# EAGLE design InkTime (EAGLE 9.7.0)

## Sheet 1 of 2
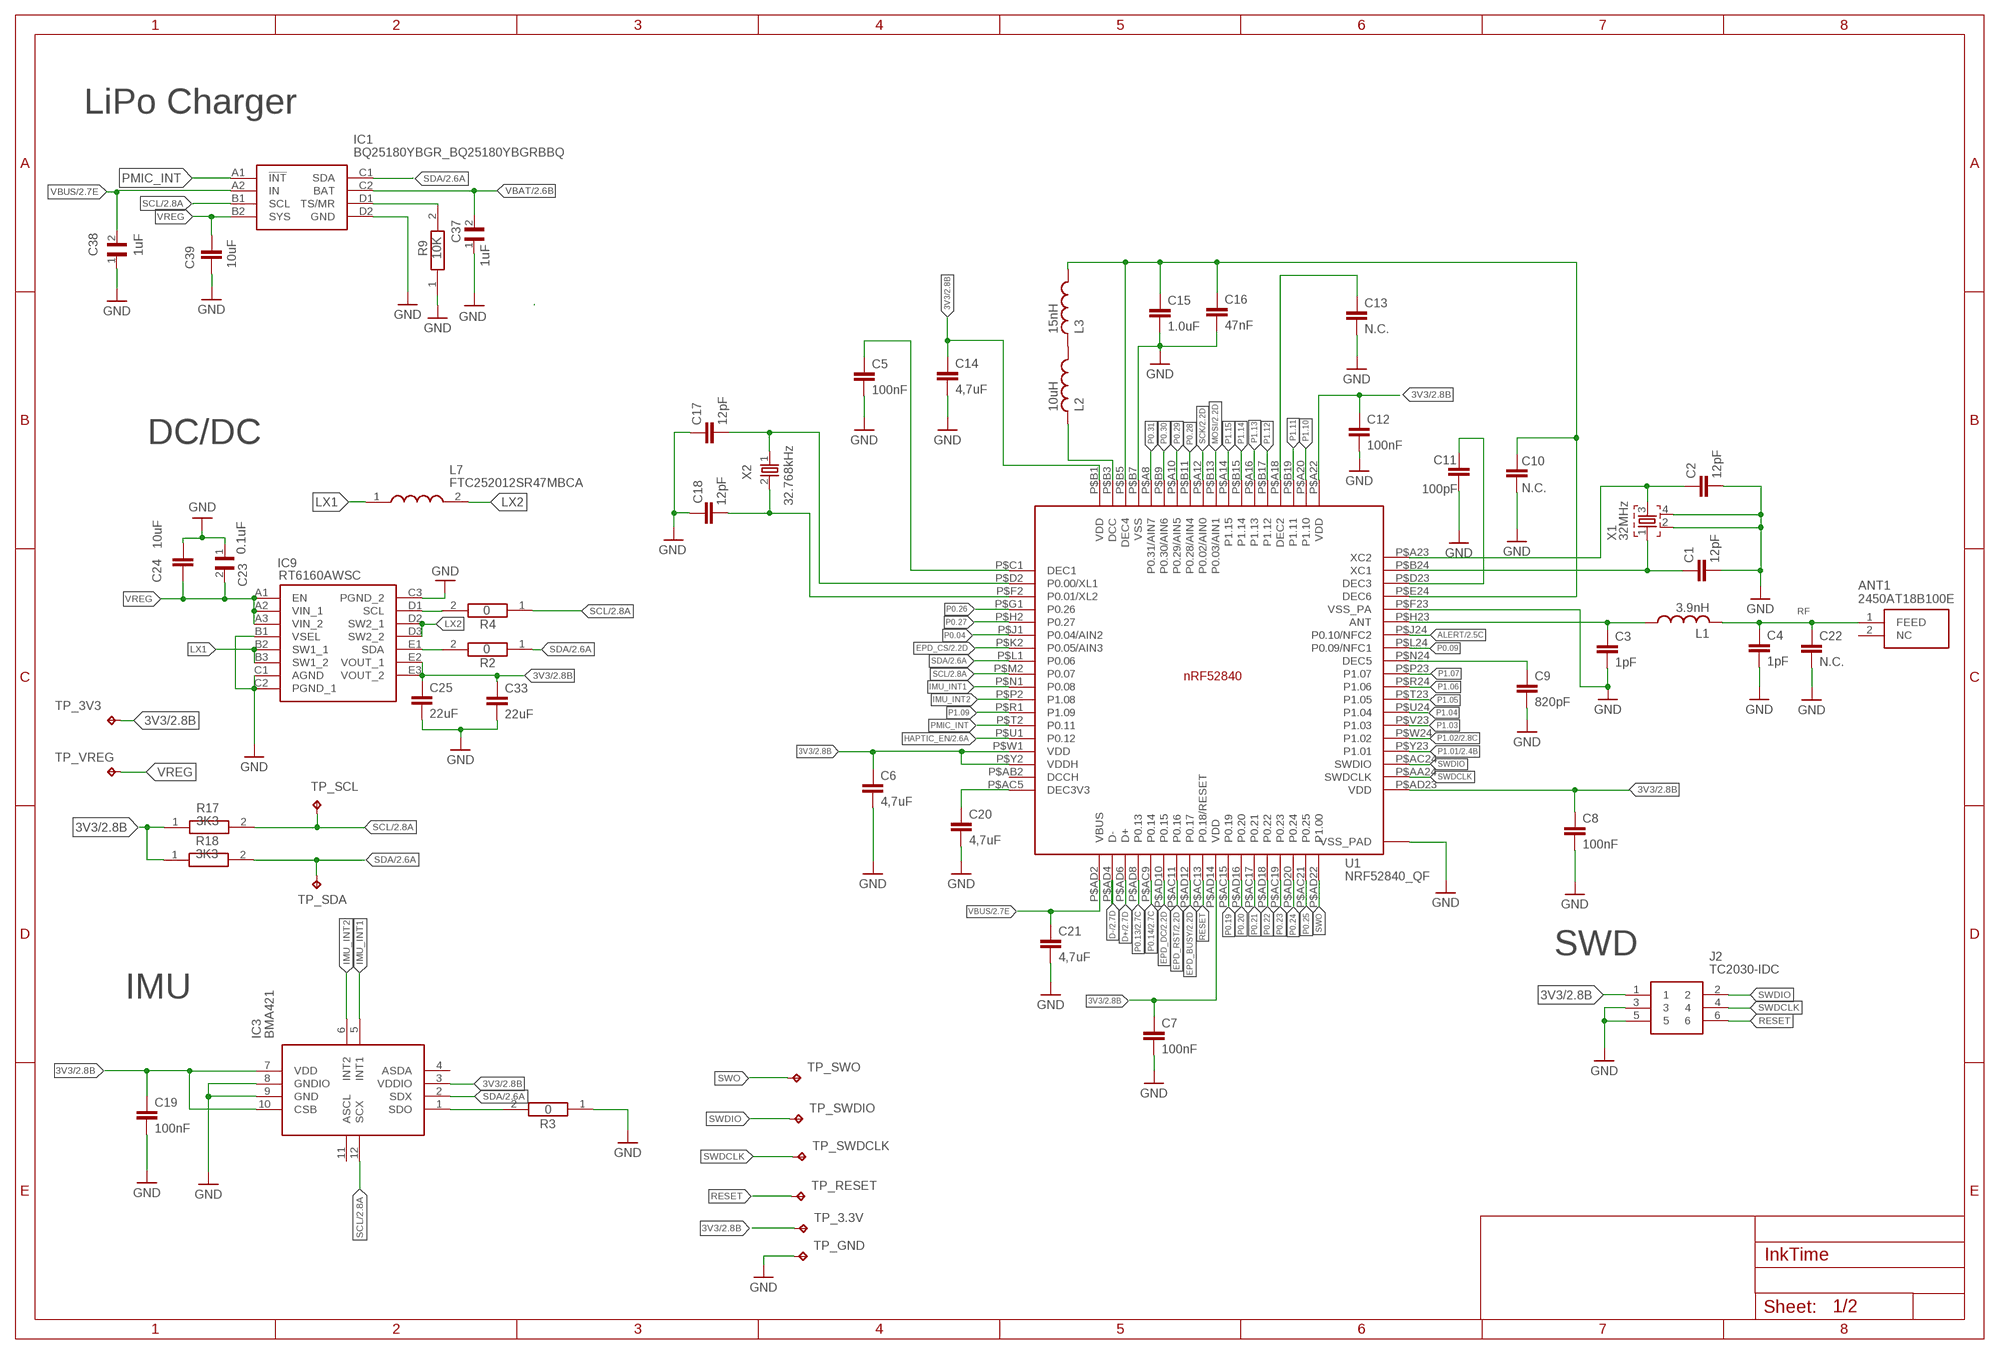
[diagram p0: schematic, sheet 1]

### Parts
ANT1  2450AT18B100E  2450AT18B100E_2450AT18B100E  [2450AT18B100E_ANTC3216X140N]
C1  12pF  NORDIC_NRF_3_CAPACITOR_0201_N  [NORDIC_NRF_3_RESC0201_N]
C2  12pF  NORDIC_NRF_3_CAPACITOR_0201_N  [NORDIC_NRF_3_RESC0201_N]
C3  1pF  NORDIC_NRF_3_CAPACITOR_0201_N  [NORDIC_NRF_3_RESC0201_N]
C4  1pF  NORDIC_NRF_3_CAPACITOR_0201_N  [NORDIC_NRF_3_RESC0201_N]
C5  100nF  NORDIC_NRF_3_CAPACITOR_0201_N  [NORDIC_NRF_3_RESC0201_N]
C6  4,7uF  NORDIC_NRF_3_CAPACITOR_0402_N  [NORDIC_NRF_3_RESC0402_N]
C7  100nF  NORDIC_NRF_3_CAPACITOR_0201_N  [NORDIC_NRF_3_RESC0201_N]
C8  100nF  NORDIC_NRF_3_CAPACITOR_0201_N  [NORDIC_NRF_3_RESC0201_N]
C9  820pF  NORDIC_NRF_3_CAPACITOR_0201_N  [NORDIC_NRF_3_RESC0201_N]
C10  N.C.  NORDIC_NRF_3_CAPACITOR_0201_N  [NORDIC_NRF_3_RESC0201_N]
C11  100pF  NORDIC_NRF_3_CAPACITOR_0201_N  [NORDIC_NRF_3_RESC0201_N]
C12  100nF  NORDIC_NRF_3_CAPACITOR_0201_N  [NORDIC_NRF_3_RESC0201_N]
C13  N.C.  NORDIC_NRF_3_CAPACITOR_0201_N  [NORDIC_NRF_3_RESC0201_N]
C14  4,7uF  NORDIC_NRF_3_CAPACITOR_0402_N  [NORDIC_NRF_3_RESC0402_N]
C15  1.0uF  NORDIC_NRF_3_CAPACITOR_0402_N  [NORDIC_NRF_3_RESC0402_N]
C16  47nF  NORDIC_NRF_3_CAPACITOR_0201_N  [NORDIC_NRF_3_RESC0201_N]
C17  12pF  NORDIC_NRF_3_CAPACITOR_0201_N  [NORDIC_NRF_3_RESC0201_N]
C18  12pF  NORDIC_NRF_3_CAPACITOR_0201_N  [NORDIC_NRF_3_RESC0201_N]
C19  100nF  NORDIC_NRF_3_CAPACITOR_0201_N  [NORDIC_NRF_3_RESC0201_N]
C20  4,7uF  NORDIC_NRF_3_CAPACITOR_0402_N  [NORDIC_NRF_3_RESC0402_N]
C21  4,7uF  NORDIC_NRF_3_CAPACITOR_0402_N  [NORDIC_NRF_3_RESC0402_N]
C22  N.C.  NORDIC_NRF_3_CAPACITOR_0201_N  [NORDIC_NRF_3_RESC0201_N]
C23  0.1uF  GRM011R60J152KE01L_2_GRM011R60J152KE01LCAPCO201XWHATEVER  [GRM011R60J152KE01L_2_CAPC0201X13N]
C24  10uF  NORDIC_NRF_3_CAPACITOR_0402_N  [NORDIC_NRF_3_RESC0402_N]
C25  22uF  NORDIC_NRF_3_CAPACITOR_0402_N  [NORDIC_NRF_3_RESC0402_N]
C33  22uF  NORDIC_NRF_3_CAPACITOR_0402_N  [NORDIC_NRF_3_RESC0402_N]
C37  1uF  GRM011R60J152KE01L_2_GRM011R60J152KE01LCAPCO201XWHATEVER  [GRM011R60J152KE01L_2_CAPC0201X13N]
C38  1uF  GRM011R60J152KE01L_2_GRM011R60J152KE01LCAPCO201XWHATEVER  [GRM011R60J152KE01L_2_CAPC0201X13N]
C39  10uF  NORDIC_NRF_3_CAPACITOR_0402_N  [NORDIC_NRF_3_RESC0402_N]
IC1  BQ25180YBGR_BQ25180YBGRBBQ  [BQ25180YBGR_BGA8C40P2X4_100X155X50]
IC3  BMA421  BMA423_BMA423BMA423  [BMA423_BMA423]
IC9  RT6160AWSC  RT6160AWSC_RT6160AWSCRT6160  [RT6160AWSC_BGA15C40P3X5_140X230X60]
J2  TC2030-IDC  TC2030-IDC_TC2030-IDC  [TC2030-IDC_TC2030IDC]
L1  3.9nH  NORDIC_NRF_2_INDUCTOR_0201_N  [NORDIC_NRF_2_RESC0201_N]
L2  10uH  NORDIC_NRF_2_INDUCTOR_0201_N  [NORDIC_NRF_2_RESC0201_N]
L3  15nH  NORDIC_NRF_2_INDUCTOR_0201_N  [NORDIC_NRF_2_RESC0201_N]
L7  FTC252012SR47MBCA  MLP2016SR47MT0S1_FTC252012SR47MBCAMLP_INDUCTOR  [MLP2016SR47MT0S1_INDC2016X100N]
R2  0  CPF0201D7K68C1_CPF0201D7K68C1  [CPF0201D7K68C1_0201]
R3  0  CPF0201D7K68C1_CPF0201D7K68C1  [CPF0201D7K68C1_0201]
R4  0  CPF0201D7K68C1_CPF0201D7K68C1  [CPF0201D7K68C1_0201]
R9  10K  CPF0201D7K68C1_CPF0201D7K68C1  [CPF0201D7K68C1_0201]
R17  3K3  CPF0201D7K68C1_CPF0201D7K68C1  [CPF0201D7K68C1_0201]
R18  3K3  CPF0201D7K68C1_CPF0201D7K68C1  [CPF0201D7K68C1_0201]
TP_3.3V  HECTOR_WATCH_1_TPTP20R  [HECTOR_WATCH_1_TP20R]
TP_3V3  HECTOR_WATCH_1_TPTP20R  [HECTOR_WATCH_1_TP20R]
TP_GND  HECTOR_WATCH_1_TPTP20R  [HECTOR_WATCH_1_TP20R]
TP_RESET  HECTOR_WATCH_1_TPTP20R  [HECTOR_WATCH_1_TP20R]
TP_SCL  HECTOR_WATCH_1_TPTP20R  [HECTOR_WATCH_1_TP20R]
TP_SDA  HECTOR_WATCH_1_TPTP20R  [HECTOR_WATCH_1_TP20R]
TP_SWDCLK  HECTOR_WATCH_1_TPTP20R  [HECTOR_WATCH_1_TP20R]
TP_SWDIO  HECTOR_WATCH_1_TPTP20R  [HECTOR_WATCH_1_TP20R]
TP_SWO  HECTOR_WATCH_1_TPTP20R  [HECTOR_WATCH_1_TP20R]
TP_VREG  HECTOR_WATCH_1_TPTP20R  [HECTOR_WATCH_1_TP20R]
U1  NRF52840_QF  NORDIC_NRF_4_NRF52840_QFNRF52840  [NORDIC_NRF_4_AQFN50P700X700X85_HS-74N]
X1  32MHz  NORDIC_NRF_XTAL_32MHZQUARTZNX2016SA  [NORDIC_NRF_BT-XTAL_2016_N]
X2  32.768kHz  NORDIC_NRF_1_XTAL_32KHZNX3215SA  [NORDIC_NRF_1_XTAL_3215_N]

### Nets
3V3: C6.1 C7.1 C8.1 C12.1 C14.1 C19.1 C25.1 C33.1 IC3.3(VDDIO) IC3.7(VDD) IC3.10(CSB) IC9.E2(VOUT_1) IC9.E3(VOUT_2) J2.1 R17.1 R18.1 TP_3.3V.TP TP_3V3.TP U1.P$A22(VDD) U1.P$AD14(VDD) U1.P$AD23(VDD) U1.P$B1(VDD) U1.P$W1(VDD) U1.P$Y2(VDDH) ; also sheet 2
ALERT: U1.P$J24(P0.10/NFC2) ; also sheet 2
D+: U1.P$AD6(D+) ; also sheet 2
D-: U1.P$AD4(D-) ; also sheet 2
EPD_BUSY: U1.P$AD12(P0.17) ; also sheet 2
EPD_CS: U1.P$K2(P0.05/AIN3) ; also sheet 2
EPD_DC: U1.P$AD10(P0.15) ; also sheet 2
EPD_RST: U1.P$AC11(P0.16) ; also sheet 2
GND: C1.2 C2.2 C3.2 C4.2 C5.2 C6.2 C7.2 C8.2 C9.2 C10.2 C11.2 C12.2 C13.2 C14.2 C15.2 C16.2 C17.1 C18.2 C19.2 C20.2 C21.2 C22.2 C23.1 C24.1 C25.2 C33.2 C37.1 C38.1 C39.2 IC1.D2(GND) IC3.8(GNDIO) IC3.9(GND) IC9.B1(VSEL) IC9.C1(AGND) IC9.C2(PGND_1) IC9.C3(PGND_2) J2.3 J2.5 R3.1 R9.1 TP_GND.TP U1.P$74(VSS_PAD) U1.P$75(VSS_PAD) U1.P$76(VSS_PAD) U1.P$77(VSS_PAD) U1.P$78(VSS_PAD) U1.P$79(VSS_PAD) U1.P$80(VSS_PAD) U1.P$81(VSS_PAD) U1.P$82(VSS_PAD) U1.P$83(VSS_PAD) U1.P$84(VSS_PAD) U1.P$85(VSS_PAD) U1.P$86(VSS_PAD) U1.P$87(VSS_PAD) U1.P$88(VSS_PAD) U1.P$89(VSS_PAD) U1.P$90(VSS_PAD) U1.P$B7(VSS) U1.P$F23(VSS_PA) X1.2 X1.4 ; also sheet 2
HAPTIC_EN: U1.P$U1(P0.12) ; also sheet 2
IMU_INT1: IC3.5(INT1) U1.P$N1(P0.08)
IMU_INT2: IC3.6(INT2) U1.P$P2(P1.08)
LX1: IC9.B2(SW1_1) IC9.B3(SW1_2) L7.1
LX2: IC9.D2(SW2_1) IC9.D3(SW2_2) L7.2
MOSI: U1.P$B13(P0.03/AIN1) ; also sheet 2
N$2: IC1.D1(TS/MR) R9.2
N$5: IC9.D1(SCL) R4.2
N$6: IC9.E1(SDA) R2.2
N$8: IC3.1(SDO) R3.2
N$9: C9.1 U1.P$N24(DEC5)
N$10: C3.1 L1.1 U1.P$H23(ANT)
N$11: C11.1 U1.P$D23(DEC3)
N$12: C10.1 C15.1 C16.1 L3.1 U1.P$B5(DEC4) U1.P$E24(DEC6)
N$13: C2.1 U1.P$A23(XC2) X1.3
N$14: C1.1 U1.P$B24(XC1) X1.1
N$15: C13.1 U1.P$A18(DEC2)
N$16: L2.1 L3.2
N$17: L2.2 U1.P$B3(DCC)
N$18: C5.1 U1.P$C1(DEC1)
N$19: C17.2 U1.P$D2(P0.00/XL1) X2.1
N$20: C18.1 U1.P$F2(P0.01/XL2) X2.2
N$21: C20.1 U1.P$AC5(DEC3V3)
P0.04: U1.P$J1(P0.04/AIN2)
P0.09: U1.P$L24(P0.09/NFC1)
P0.13: U1.P$AD8(P0.13) ; also sheet 2
P0.14: U1.P$AC9(P0.14) ; also sheet 2
P0.19: U1.P$AC15(P0.19)
P0.20: U1.P$AD16(P0.20)
P0.21: U1.P$AC17(P0.21)
P0.22: U1.P$AD18(P0.22)
P0.23: U1.P$AC19(P0.23)
P0.24: U1.P$AD20(P0.24)
P0.25: U1.P$AC21(P0.25)
P0.26: U1.P$G1(P0.26)
P0.27: U1.P$H2(P0.27)
P0.28: U1.P$B11(P0.28/AIN4)
P0.29: U1.P$A10(P0.29/AIN5)
P0.30: U1.P$B9(P0.30/AIN6)
P0.31: U1.P$A8(P0.31/AIN7)
P1.01: U1.P$Y23(P1.01) ; also sheet 2
P1.02: U1.P$W24(P1.02) ; also sheet 2
P1.03: U1.P$V23(P1.03)
P1.04: U1.P$U24(P1.04)
P1.05: U1.P$T23(P1.05)
P1.06: U1.P$R24(P1.06)
P1.07: U1.P$P23(P1.07)
P1.09: U1.P$R1(P1.09)
P1.10: U1.P$A20(P1.10)
P1.11: U1.P$B19(P1.11)
P1.12: U1.P$B17(P1.12)
P1.13: U1.P$A16(P1.13)
P1.14: U1.P$B15(P1.14)
P1.15: U1.P$A14(P1.15)
PMIC_INT: IC1.A1(!INT) U1.P$T2(P0.11)
RESET: J2.6 TP_RESET.TP U1.P$AC13(P0.18/RESET)
RF: ANT1.1(FEED) C4.1 C22.1 L1.2
SCK: U1.P$A12(P0.02/AIN0) ; also sheet 2
SCL: IC1.B1(SCL) IC3.12(SCX) R4.1 R17.2 TP_SCL.TP U1.P$M2(P0.07) ; also sheet 2
SDA: IC1.C1(SDA) IC3.2(SDX) R2.1 R18.2 TP_SDA.TP U1.P$L1(P0.06) ; also sheet 2
SWDCLK: J2.4 TP_SWDCLK.TP U1.P$AA24(SWDCLK)
SWDIO: J2.2 TP_SWDIO.TP U1.P$AC24(SWDIO)
SWO: TP_SWO.TP U1.P$AD22(P1.00)
VBAT: C37.2 IC1.C2(BAT) ; also sheet 2
VBUS: C21.1 C38.2 IC1.A2(IN) U1.P$AD2(VBUS) ; also sheet 2
VREG: C23.2 C24.2 C39.1 IC1.B2(SYS) IC9.A1(EN) IC9.A2(VIN_1) IC9.A3(VIN_2) TP_VREG.TP
Unconnected: ANT1.2(NC) IC3.4(ASDA) IC3.11(ASCL) U1.P$AB2(DCCH)

### Notes on the sheet
- LiPo Charger
- DC/DC
- SWD
- IMU

## Sheet 2 of 2
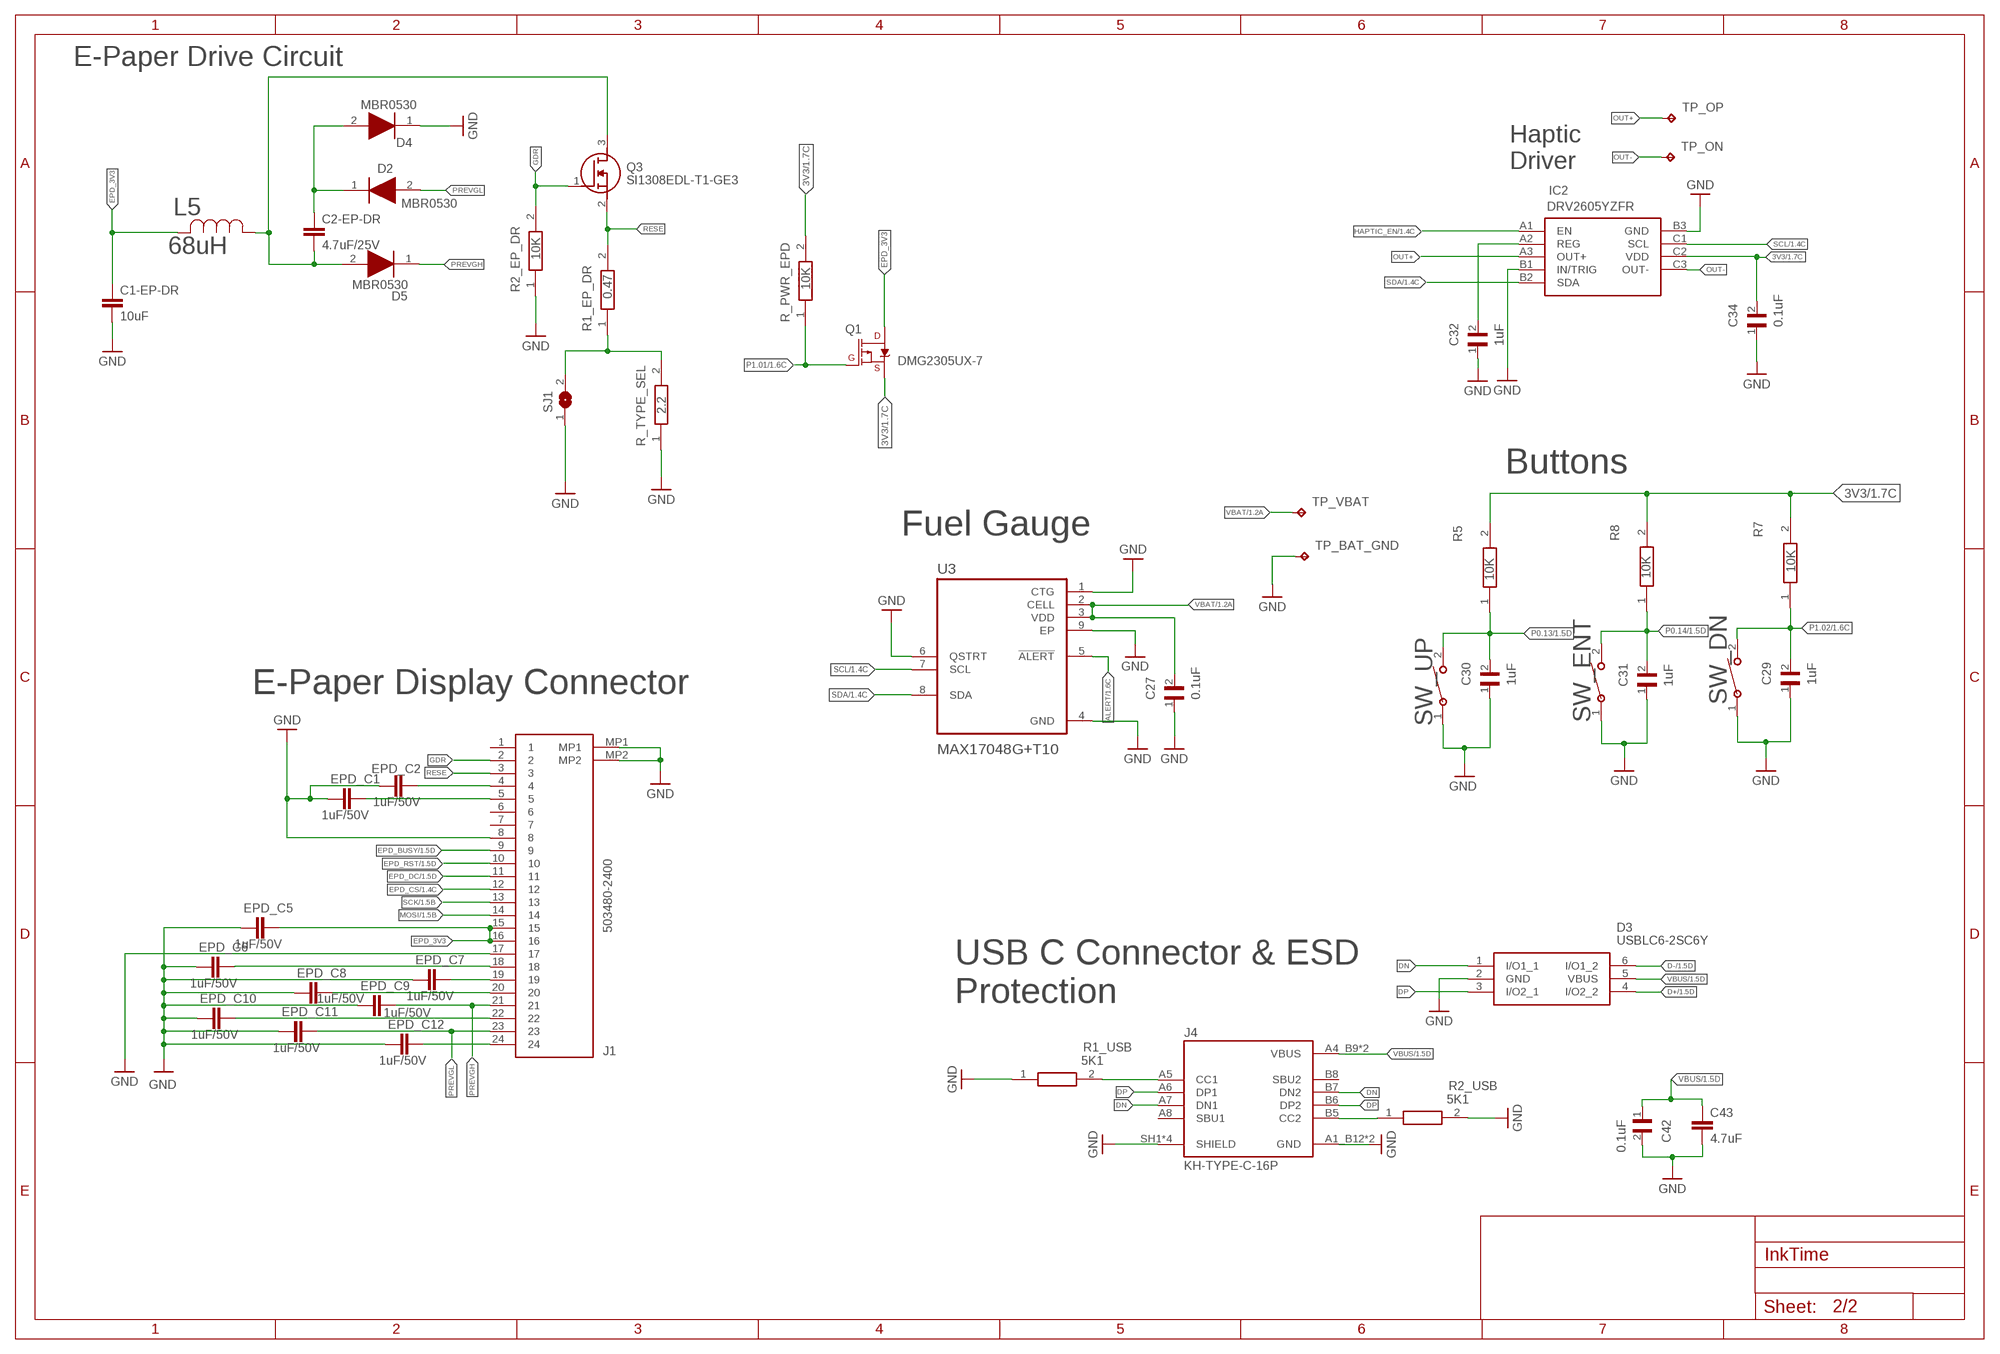
[diagram p1: schematic, sheet 2]

### Parts
C1-EP-DR  10uF  NORDIC_NRF_3_CAPACITOR_0402_N  [NORDIC_NRF_3_RESC0402_N]
C2-EP-DR  4.7uF/25V  NORDIC_NRF_3_CAPACITOR_0402_N  [NORDIC_NRF_3_RESC0402_N]
C27  0.1uF  GRM011R60J152KE01L_2_GRM011R60J152KE01LCAPCO201XWHATEVER  [GRM011R60J152KE01L_2_CAPC0201X13N]
C29  1uF  GRM011R60J152KE01L_2_GRM011R60J152KE01LCAPCO201XWHATEVER  [GRM011R60J152KE01L_2_CAPC0201X13N]
C30  1uF  GRM011R60J152KE01L_2_GRM011R60J152KE01LCAPCO201XWHATEVER  [GRM011R60J152KE01L_2_CAPC0201X13N]
C31  1uF  GRM011R60J152KE01L_2_GRM011R60J152KE01LCAPCO201XWHATEVER  [GRM011R60J152KE01L_2_CAPC0201X13N]
C32  1uF  GRM011R60J152KE01L_2_GRM011R60J152KE01LCAPCO201XWHATEVER  [GRM011R60J152KE01L_2_CAPC0201X13N]
C34  0.1uF  GRM011R60J152KE01L_2_GRM011R60J152KE01LCAPCO201XWHATEVER  [GRM011R60J152KE01L_2_CAPC0201X13N]
C42  0.1uF  GRM011R60J152KE01L_2_GRM011R60J152KE01LCAPCO201XWHATEVER  [GRM011R60J152KE01L_2_CAPC0201X13N]
C43  4.7uF  NORDIC_NRF_3_CAPACITOR_0402_N  [NORDIC_NRF_3_RESC0402_N]
D2  MBR0530  ESP32_C6_LIBRARY_5_MBR0530  [ESP32_C6_LIBRARY_5_SOD3716X135N]
D3  USBLC6-2SC6Y  ESP32_C6_LIBRARY_3_USBLC6-2SC6YUSBLC6-2SC6Y  [ESP32_C6_LIBRARY_3_SOT95P280X145-6N]
D4  MBR0530  ESP32_C6_LIBRARY_5_MBR0530DIODE  [ESP32_C6_LIBRARY_5_SOD3716X135N]
D5  MBR0530  ESP32_C6_LIBRARY_5_MBR0530DIODE  [ESP32_C6_LIBRARY_5_SOD3716X135N]
EPD_C1  1uF/50V  NORDIC_NRF_3_CAPACITOR_0402_N  [NORDIC_NRF_3_RESC0402_N]
EPD_C2  1uF/50V  NORDIC_NRF_3_CAPACITOR_0402_N  [NORDIC_NRF_3_RESC0402_N]
EPD_C5  1uF/50V  NORDIC_NRF_3_CAPACITOR_0402_N  [NORDIC_NRF_3_RESC0402_N]
EPD_C6  1uF/50V  NORDIC_NRF_3_CAPACITOR_0402_N  [NORDIC_NRF_3_RESC0402_N]
EPD_C7  1uF/50V  NORDIC_NRF_3_CAPACITOR_0402_N  [NORDIC_NRF_3_RESC0402_N]
EPD_C8  1uF/50V  NORDIC_NRF_3_CAPACITOR_0402_N  [NORDIC_NRF_3_RESC0402_N]
EPD_C9  1uF/50V  NORDIC_NRF_3_CAPACITOR_0402_N  [NORDIC_NRF_3_RESC0402_N]
EPD_C10  1uF/50V  NORDIC_NRF_3_CAPACITOR_0402_N  [NORDIC_NRF_3_RESC0402_N]
EPD_C11  1uF/50V  NORDIC_NRF_3_CAPACITOR_0402_N  [NORDIC_NRF_3_RESC0402_N]
EPD_C12  1uF/50V  NORDIC_NRF_3_CAPACITOR_0402_N  [NORDIC_NRF_3_RESC0402_N]
IC2  DRV2605YZFR  DRV2605YZFR_DRV2605YZFRHAPTIC_DRIVE  [DRV2605YZFR_BGA9C50P3X3_144X144X62]
J1  503480-2400  503480-2400_503480-2400  [503480-2400_5034802400]
J4  KH-TYPE-C-16P  KH-TYPE-C-16P_KH-TYPE-C-16PTYPECKH  [KH-TYPE-C-16P_KINGHELM_KH-TYPE-C-16P]
L5  68uH  ESP32_C6_LIBRARY_2_744043680IND_4828-WE-TPC_WRE  [ESP32_C6_LIBRARY_2_IND_4828-WE-TPC_WRE]
Q1  DMG2305UX-7  ESP32_C6_LIBRARY_4_ESP32_WROVER_SPARKFUN-DISCRETESEMI_MOSFET_PCH  [ESP32_C6_LIBRARY_4_ESP32_C6_LIBRARY_4_ESP32_C6_LIBRARY_4_ESP32_C6_LIBRARY_4_ESP32_WROVER_SPARKFUN-DISCRETESEMI_SOT23-3]
Q3  SI1308EDL-T1-GE3  ESP32_C6_LIBRARY_6_SI1308EDL-T1-GE3MOSFET  [ESP32_C6_LIBRARY_6_SOT65P210X110-3N]
R1_EP_DR  0.47  CPF0201D7K68C1_CPF0201D7K68C1  [CPF0201D7K68C1_0201]
R1_USB  5K1  CPF0201D7K68C1_CPF0201D7K68C1  [CPF0201D7K68C1_0201]
R2_EP_DR  10K  CPF0201D7K68C1_CPF0201D7K68C1  [CPF0201D7K68C1_0201]
R2_USB  5K1  CPF0201D7K68C1_CPF0201D7K68C1  [CPF0201D7K68C1_0201]
R5  10K  CPF0201D7K68C1_CPF0201D7K68C1  [CPF0201D7K68C1_0201]
R7  10K  CPF0201D7K68C1_CPF0201D7K68C1  [CPF0201D7K68C1_0201]
R8  10K  CPF0201D7K68C1_CPF0201D7K68C1  [CPF0201D7K68C1_0201]
R_PWR_EPD  10K  CPF0201D7K68C1_CPF0201D7K68C1  [CPF0201D7K68C1_0201]
R_TYPE_SEL  2.2  CPF0201D7K68C1_CPF0201D7K68C1  [CPF0201D7K68C1_0201]
SJ1  ESP32_C6_LIBRARY_7_JUMPER_SJ  [ESP32_C6_LIBRARY_7_JUMPER_SJ]
SW_DN  2025-10-22_07-23-44_LIBRARY_EVP-AKE31A  [2025-10-22_07-23-44_LIBRARY_SW_EVP-AKE31A_PAN]
SW_ENT  2025-10-22_07-23-44_LIBRARY_EVP-AKE31A  [2025-10-22_07-23-44_LIBRARY_SW_EVP-AKE31A_PAN]
SW_UP  2025-10-22_07-23-44_LIBRARY_EVP-AKE31A  [2025-10-22_07-23-44_LIBRARY_SW_EVP-AKE31A_PAN]
TP_BAT_GND  HECTOR_WATCH_1_TPTP20R  [HECTOR_WATCH_1_TP20R]
TP_ON  HECTOR_WATCH_1_TPTP20R  [HECTOR_WATCH_1_TP20R]
TP_OP  HECTOR_WATCH_1_TPTP20R  [HECTOR_WATCH_1_TP20R]
TP_VBAT  HECTOR_WATCH_1_TPTP20R  [HECTOR_WATCH_1_TP20R]
U3  MAX17048G+T10  ESP32_C6_LIBRARY_MAX17048G+T10MAX  [ESP32_C6_LIBRARY_SON50P200X200X80-9N]

### Nets
3V3: C34.2 IC2.C2(VDD) Q1.2(S) R5.2 R7.2 R8.2 R_PWR_EPD.2 ; also sheet 1
ALERT: U3.5(!ALERT) ; also sheet 1
D+: D3.4(I/O2_2) ; also sheet 1
D-: D3.6(I/O1_2) ; also sheet 1
DN: D3.1(I/O1_1) J4.A7(DN1) J4.B7(DN2)
DP: D3.3(I/O2_1) J4.A6(DP1) J4.B6(DP2)
EPD_3V3: C1-EP-DR.1 EPD_C5.2 J1.15 J1.16 L5.2 Q1.3(D)
EPD_BUSY: J1.9 ; also sheet 1
EPD_CS: J1.12 ; also sheet 1
EPD_DC: J1.11 ; also sheet 1
EPD_RST: J1.10 ; also sheet 1
GDR: J1.2 Q3.1(G) R2_EP_DR.2
GND: C1-EP-DR.2 C27.1 C29.1 C30.1 C31.1 C32.1 C34.1 C42.2 C43.2 D3.2(GND) D4.1(K) EPD_C1.1 EPD_C2.1 EPD_C5.1 EPD_C6.1 EPD_C7.1 EPD_C8.1 EPD_C9.1 EPD_C10.1 EPD_C11.1 EPD_C12.1 IC2.B1(IN/TRIG) IC2.B3(GND) J1.8 J1.17 J1.MP1 J1.MP2 J4.A1_B12(GND) J4.A12_B1(GND) J4.SH1(SHIELD) J4.SH2(SHIELD) J4.SH3(SHIELD) J4.SH4(SHIELD) R1_USB.1 R2_EP_DR.1 R2_USB.2 R_TYPE_SEL.1 SJ1.1 SW_DN.1 SW_ENT.1 SW_UP.1 TP_BAT_GND.TP U3.1(CTG) U3.4(GND) U3.6(QSTRT) U3.9(EP) ; also sheet 1
HAPTIC_EN: IC2.A1(EN) ; also sheet 1
MOSI: J1.14 ; also sheet 1
N$22: C32.2 IC2.A2(REG)
N$23: J4.A5(CC1) R1_USB.2
N$24: J4.B5(CC2) R2_USB.1
N$25: C2-EP-DR.2 D5.2(A) L5.1 Q3.3(D)
N$26: C2-EP-DR.1 D2.1(K) D4.2(A)
N$27: R1_EP_DR.1 R_TYPE_SEL.2 SJ1.2
N$29: EPD_C2.2 J1.4
N$30: EPD_C1.2 J1.5
N$31: EPD_C6.2 J1.18
N$32: EPD_C7.2 J1.19
N$33: EPD_C8.2 J1.20
N$35: EPD_C10.2 J1.22
N$37: EPD_C12.2 J1.24
OUT+: IC2.A3(OUT+) TP_OP.TP
OUT-: IC2.C3(OUT-) TP_ON.TP
P0.13: C30.2 R5.1 SW_UP.2 ; also sheet 1
P0.14: C31.2 R8.1 SW_ENT.2 ; also sheet 1
P1.01: Q1.1(G) R_PWR_EPD.1 ; also sheet 1
P1.02: C29.2 R7.1 SW_DN.2 ; also sheet 1
PREVGH: D5.1(K) EPD_C9.2 J1.21
PREVGL: D2.2(A) EPD_C11.2 J1.23
RESE: J1.3 Q3.2(S) R1_EP_DR.2
SCK: J1.13 ; also sheet 1
SCL: IC2.C1(SCL) U3.7(SCL) ; also sheet 1
SDA: IC2.B2(SDA) U3.8(SDA) ; also sheet 1
VBAT: C27.2 TP_VBAT.TP U3.2(CELL) U3.3(VDD) ; also sheet 1
VBUS: C42.1 C43.1 D3.5(VBUS) J4.A4_B9(VBUS) J4.A9_B4(VBUS) ; also sheet 1
Unconnected: J1.1 J1.6 J1.7 J4.A8(SBU1) J4.B8(SBU2)

### Notes on the sheet
- E-Paper Drive Circuit
- Haptic
  Driver
- Buttons
- Fuel Gauge
- E-Paper Display Connector
- USB C Connector & ESD
  Protection

## Library data of the parts
ANT1 = InkTime_v5:2450AT18B100E_2450AT18B100E: Antennas 2.45GHz ANTENNA Source: Datasheet <https://www.johansontechnology.com/datasheets/2450AT18B100/2450AT18B100.pdf>; ARROW_PART_NUMBER: 2450AT18B100E; ARROW_PRICE-STOCK: https://www.arrow.com/en/products/2450at18b100e/johanson-dielectrics?utm_currency=USD&region=nac; DESCRIPTION: Antennas 2.45GHz ANTENNA; HEIGHT: 1.4mm; MANUFACTURER_NAME: JOHANSON TECHNOLOGY; MANUFACTURER_PART_NUMBER: 2450AT18B100E; MOUSER_PART_NUMBER: 609-2450AT18B100E; MOUSER_PRICE-STOCK: https://www.mouser.co.uk/ProductDetail/Johanson-Technology/2450AT18B100E?qs=yCnrNFeXz%252Bh5MFsFIXGZGA%3D%3D
C1 C1-EP-DR C2 C2-EP-DR C3-C14 C16-C22 C24 C25 C33 C39 C43 EPD_C1 EPD_C2 EPD_C5-EPD_C12 = InkTime_v5:NORDIC_NRF_3_CAPACITOR: Generic chip capacitor
C15 = InkTime_v5:NORDIC_NRF_3_CAPACITOR: Generic chip capacitor; SPICEPREFIX: B
C23 C27 C29-C32 C34 C37 C38 C42 = InkTime_v5:GRM011R60J152KE01L_2_GRM011R60J152KE01L: Check availability <https://pricing.snapeda.com/parts/GRM011R60J152KE01L/Murata/view-part?ref=eda>
D2 = InkTime_v5:ESP32_C6_LIBRARY_5_MBR0530: ON SEMICONDUCTOR - MBR0530 - DIODE, SCHOTTKY, 0.5A, 30V, SOD-123 Source: Datasheet <http://www.onsemi.com/pub/Collateral/MBR0530T1-D.PDF> Check availability <https://pricing.snapeda.com/parts/MBR0530/ON%20Semiconductor/view-part?ref=eda>; AVAILABILITY: In Stock; CHECK_PRICES: https://www.snapeda.com/parts/MBR0530/Onsemi/view-part/?ref=eda; DESCRIPTION: Diode Schottky 30 V 500mA Surface Mount SOD-123; MF: ON Semiconductor; MP: MBR0530; PACKAGE: SOD-123-2 ON Semiconductor; PRICE: None; PURCHASE-URL: https://www.snapeda.com/api/url_track_click_mouser/?unipart_id=179458&manufacturer=ON Semiconductor&part_name=MBR0530&search_term=None; SNAPEDA_LINK: https://www.snapeda.com/parts/MBR0530/Onsemi/view-part/?ref=snap
D3 = InkTime_v5:ESP32_C6_LIBRARY_3_USBLC6-2SC6Y: Low Cap. ESD Protection Auto SOT-23-6 STMicroelectronics USBLC6-2SC6Y, Dual Uni-Directional TVS Diode Array, 6-Pin SOT-23 Source: Datasheet <https://componentsearchengine.com/Datasheets/1/USBLC6-2SC6Y.pdf> Check availability <https://pricing.snapeda.com/parts/USBLC6-2SC6Y/STMicroelectronics/view-part?ref=eda>
D4 D5 = InkTime_v5:ESP32_C6_LIBRARY_5_MBR0530: ON SEMICONDUCTOR - MBR0530 - DIODE, SCHOTTKY, 0.5A, 30V, SOD-123 Source: Datasheet <http://www.onsemi.com/pub/Collateral/MBR0530T1-D.PDF> Check availability <https://pricing.snapeda.com/parts/MBR0530/ON%20Semiconductor/view-part?ref=eda>
IC1 = InkTime_v5:BQ25180YBGR_BQ25180YBGR: Charger IC Lithium Ion/Polymer, Lithium Iron Phosphate 8-DSBGA (1.6x1.1) Source: Datasheet <https://www.ti.com/lit/ds/symlink/bq25180.pdf?ts=1650264094470&ref_url=https%3A%2F%2Fwww.ti.com%2Fproduct%2FBQ25180>
IC2 = InkTime_v5:DRV2605YZFR_DRV2605YZFR: Haptic Driver for ERM/LRA with Built-In Library and Smart Loop Architecture Source: Datasheet <http://www.ti.com/lit/gpn/drv2605>
IC3 = InkTime_v5:BMA423_BMA423: Accelerometers Triaxial low-g 12bit Acceleration Sensor Source: Datasheet <https://www.mouser.com/datasheet/2/783/BST-BMA423-DS000-1509600.pdf>
IC9 = InkTime_v5:RT6160AWSC_RT6160AWSC: Buck-Boost Regulator Positive Output Step-Up/Step-Down I2C DC-DC Controller IC 15-WL-CSP (BSC) (1.4x2.3) Source: Datasheet <https://www.richtek.com/SaveDownload.aspx?specid=RT6160A>
J1 = InkTime_v5:503480-2400_503480-2400: FFC & FPC Connectors 0.5mm FPC RA SMT Dual Contact 24Ckt Source: Datasheet <https://componentsearchengine.com/Datasheets/1/503480-2400.pdf>; DESCRIPTION: FFC & FPC Connectors 0.5mm FPC RA SMT Dual Contact 24Ckt; HEIGHT: 1.87mm; MANUFACTURER_NAME: Molex; MANUFACTURER_PART_NUMBER: 503480-2400; MOUSER_PART_NUMBER: 538-503480-2400; MOUSER_PRICE-STOCK: https://www.mouser.co.uk/ProductDetail/Molex/503480-2400?qs=OAhjpuo3Vu7efIoxFh9AOw%3D%3D
J2 = InkTime_v5:TC2030-IDC_TC2030-IDC: CABLE ADAPTER 6 POS Source: Datasheet <https://datasheet.datasheetarchive.com/originals/distributors/Datasheets_SAMA/62bc384e093448baaaa63dbd0b9d8707.pdf>; DESCRIPTION: CABLE ADAPTER 6 POS; HEIGHT: 19mm; MANUFACTURER_NAME: Tag Connect; MANUFACTURER_PART_NUMBER: TC2030-IDC
J4 = InkTime_v5:KH-TYPE-C-16P_KH-TYPE-C-16P: Check availability <https://pricing.snapeda.com/parts/KH-TYPE-C-16P/kinghelm/view-part?ref=eda>
L1-L3 = InkTime_v5:NORDIC_NRF_2_INDUCTOR: Generic chip inductor
L5 = InkTime_v5:ESP32_C6_LIBRARY_2_744043680; COPYRIGHT: Copyright (C) 2024 Ultra Librarian. All rights reserved.; MANUFACTURER_PART_NUMBER: 744043680; MFR_NAME: Wurth Electronics
L7 = InkTime_v5:MLP2016SR47MT0S1_FTC252012SR47MBCA: SMD / SMT Inductors (Coils), L=0.47?H, L x W x T : Source: Datasheet <https://product.tdk.com/system/files/dam/doc/product/inductor/inductor/smd/catalog/inductor_commercial_power_mlp2016_en.pdf>
Q1 = InkTime_v5:ESP32_C6_LIBRARY_4_ESP32_WROVER_SPARKFUN-DISCRETESEMI_MOSFET_PCH: P-channel MOSFETs Voltage controlled devices that allow control of high current outputs. SparkFun Products: SparkFun ESP32 Thing <https://www.sparkfun.com/products/13907> SparkFun ESP8266 Thing <https://www.sparkfun.com/products/13231> SparkFun Pi Servo HAT V2 <https://www.sparkfun.com/products/15316> DMG2305UX-7 (20V/4.2A/SOT23-3)
Q3 = InkTime_v5:ESP32_C6_LIBRARY_6_SI1308EDL-T1-GE3: MOSFET N-Ch 30V 1.5A TrenchFET SC70 Vishay Si1308EDL-T1-GE3 N-channel MOSFET Transistor, 1.5 A, 30 V, 3-Pin SC-70 Source: Datasheet <https://componentsearchengine.com/Datasheets/1/SI1308EDL-T1-GE3.pdf> Check availability <https://pricing.snapeda.com/parts/SI1308EDL-T1-GE3/Vishay%20Siliconix/view-part?ref=eda>
R1_EP_DR R1_USB R2 R2_EP_DR R2_USB R3-R5 R7-R9 R17 R18 R_PWR_EPD R_TYPE_SEL = InkTime_v5:CPF0201D7K68C1_CPF0201D7K68C1: 7.68k 0201 Thin Film Surface Mount Fixed Resistor +/-0.5% 0.031W CPF0201D7K68C1 Source: Datasheet <http://www.te.com/commerce/DocumentDelivery/DDEController?Action=showdoc&DocId=Data Sheet1773200-1ApdfEnglishENG_DS_1773200-1_A.pdf4-2176215-6>
SJ1 = InkTime_v5:ESP32_C6_LIBRARY_7_JUMPER_SJ: SMD solder JUMPER
SW_DN SW_ENT SW_UP = InkTime_v5:2025-10-22_07-23-44_LIBRARY_EVP-AKE31A
TP_3.3V TP_3V3 TP_BAT_GND TP_GND TP_ON TP_OP TP_RESET TP_SCL TP_SDA TP_SWDCLK TP_SWDIO TP_SWO TP_VBAT TP_VREG = InkTime_v5:HECTOR_WATCH_1_TP: Test pad
U1 = InkTime_v5:NORDIC_NRF_4_NRF52840_QF: nRF52840 Features Advanced Single chip 2.4 GHz multi-protocol SoC 32-bit ARM Cortex-M4F Processor 1.7v to 5.5v operation 1MB flash + 256kB RAM Bluetooth 5 support for long range and high throughput 802.15.4 radio support On-chip NFC PPI –Programmable Peripheral Interconnect Automated power management system with automatic power management of each peripheral Configurable I/O mapping for analog and digital I/O 48 x GPIO 1 x QSPI 4 x Master/Slave SPI 2 x Two-wire interface (I²C) I²S interface 2 x UART 4 x PWM USB 2.0 controller ARM TrustZone CryptoCell-310 Cryptographic and security module AES 128-bit ECB/CCM/AAR hardware accelerator Digital microphone interface (PDM) Quadrature decoder 12-bit ADC Low power comparator On-chip 50Ω balun On-air compatible with nRF52, nRF51 and nRF24 Series Applications Advanced high performance wearables Wearables for secure payments Virtual Reality/Augmented Reality systems Smart Home sensor networks Smart city sensor networks High performance HID controllers Internet of Things (IoT) sensor networks Smart door locks Smart lighting networks Connected white goods
U3 = InkTime_v5:ESP32_C6_LIBRARY_MAX17048G+T10: Check availability <https://pricing.snapeda.com/parts/MAX17048G%2BT10/Analog%20Devices/view-part?ref=eda>
X1 = InkTime_v5:NORDIC_NRF_XTAL_32MHZ
X2 = InkTime_v5:NORDIC_NRF_1_XTAL_32KHZ

## Board
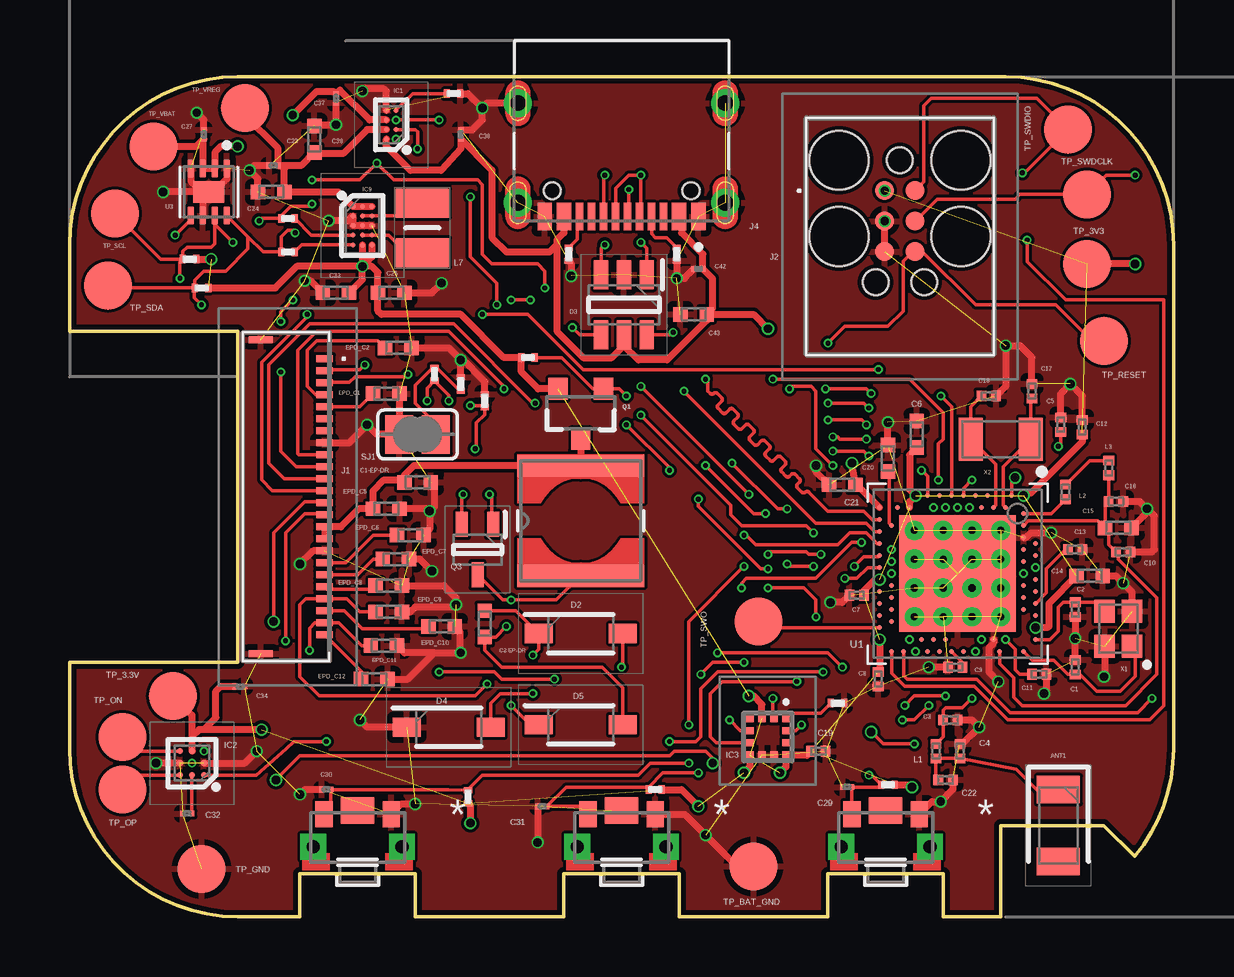
[diagram p2: board, top side]
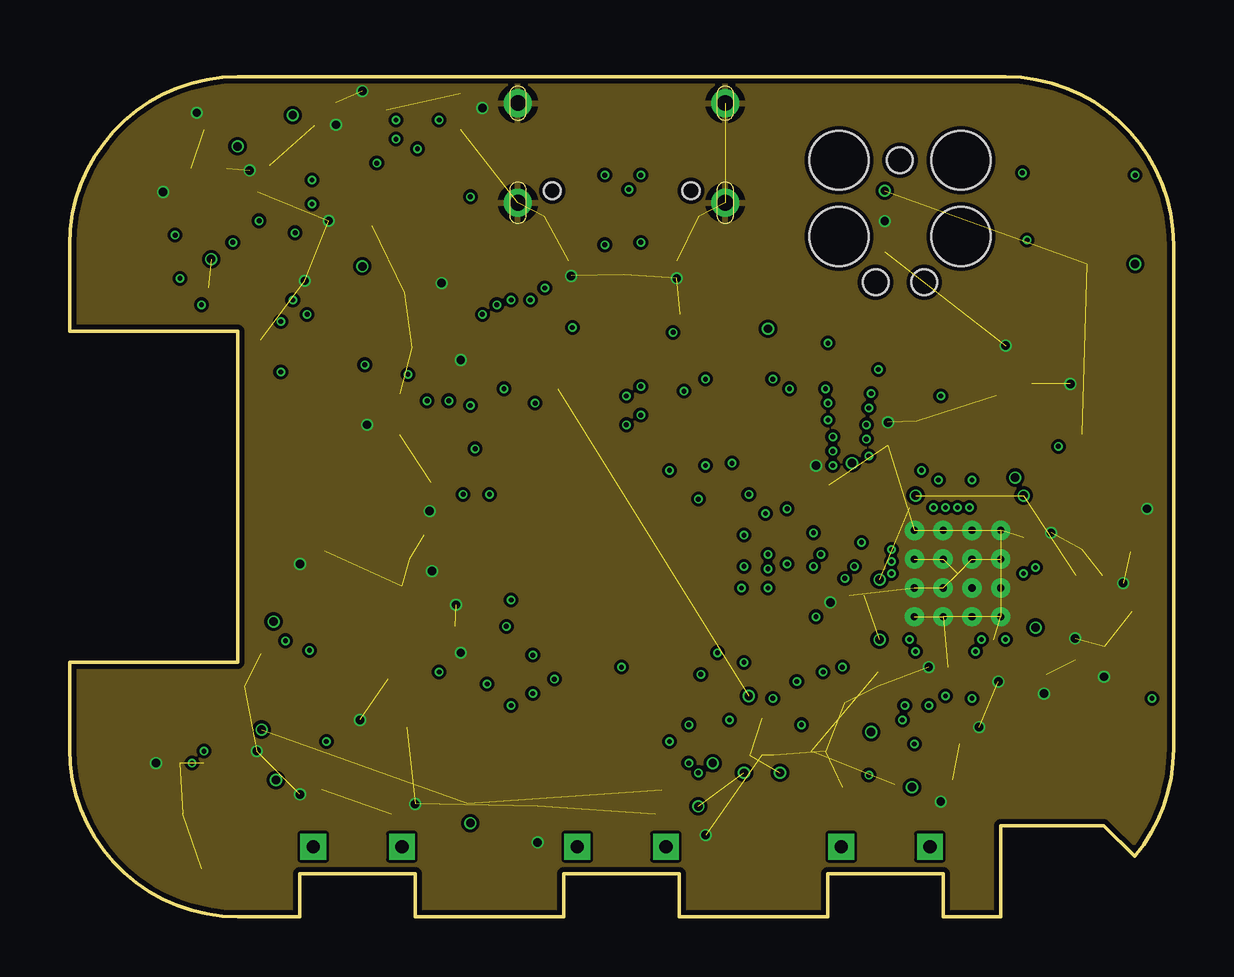
[diagram p3: board, inner layer Route2]
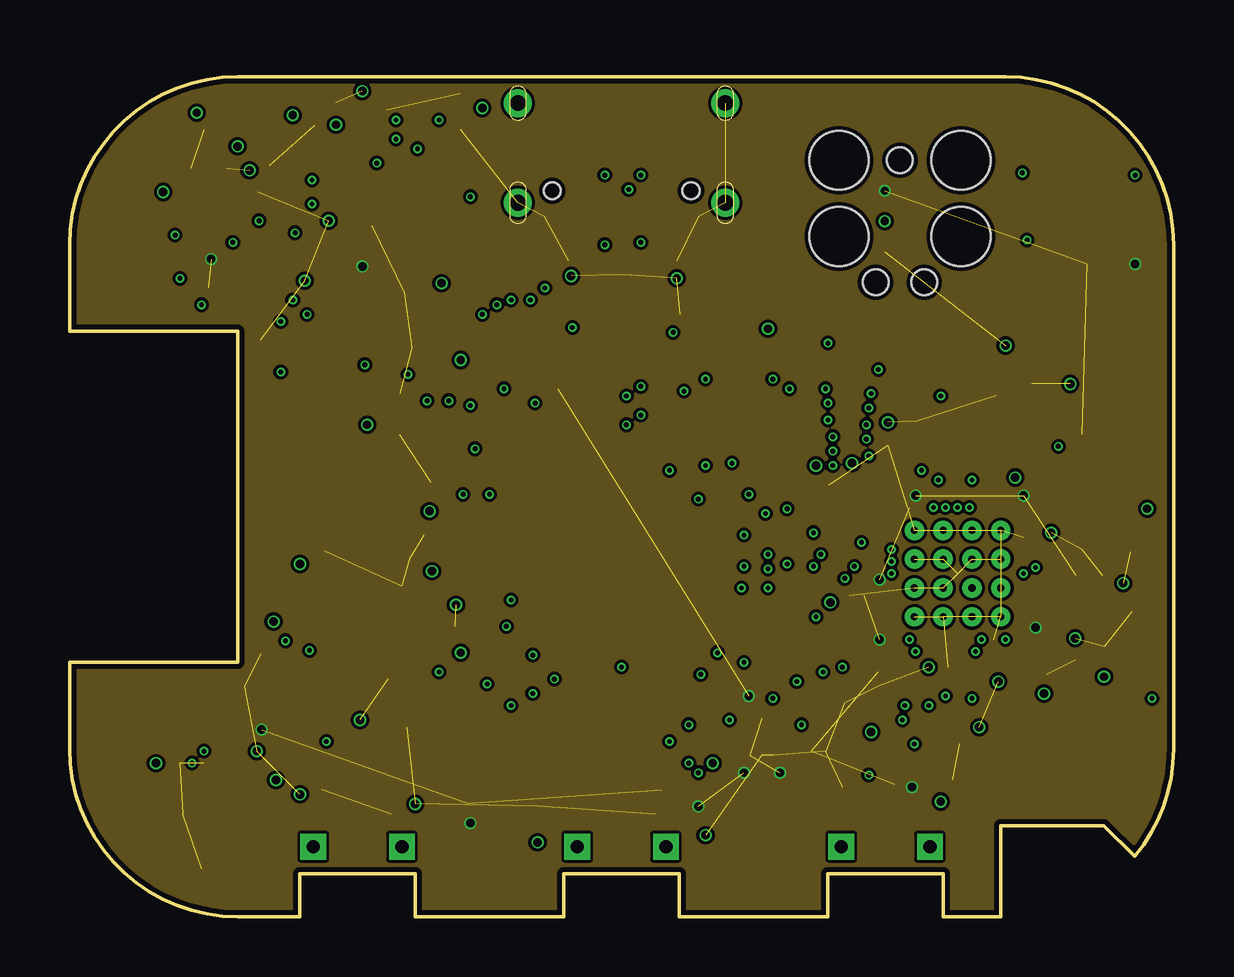
[diagram p4: board, inner layer Route15]
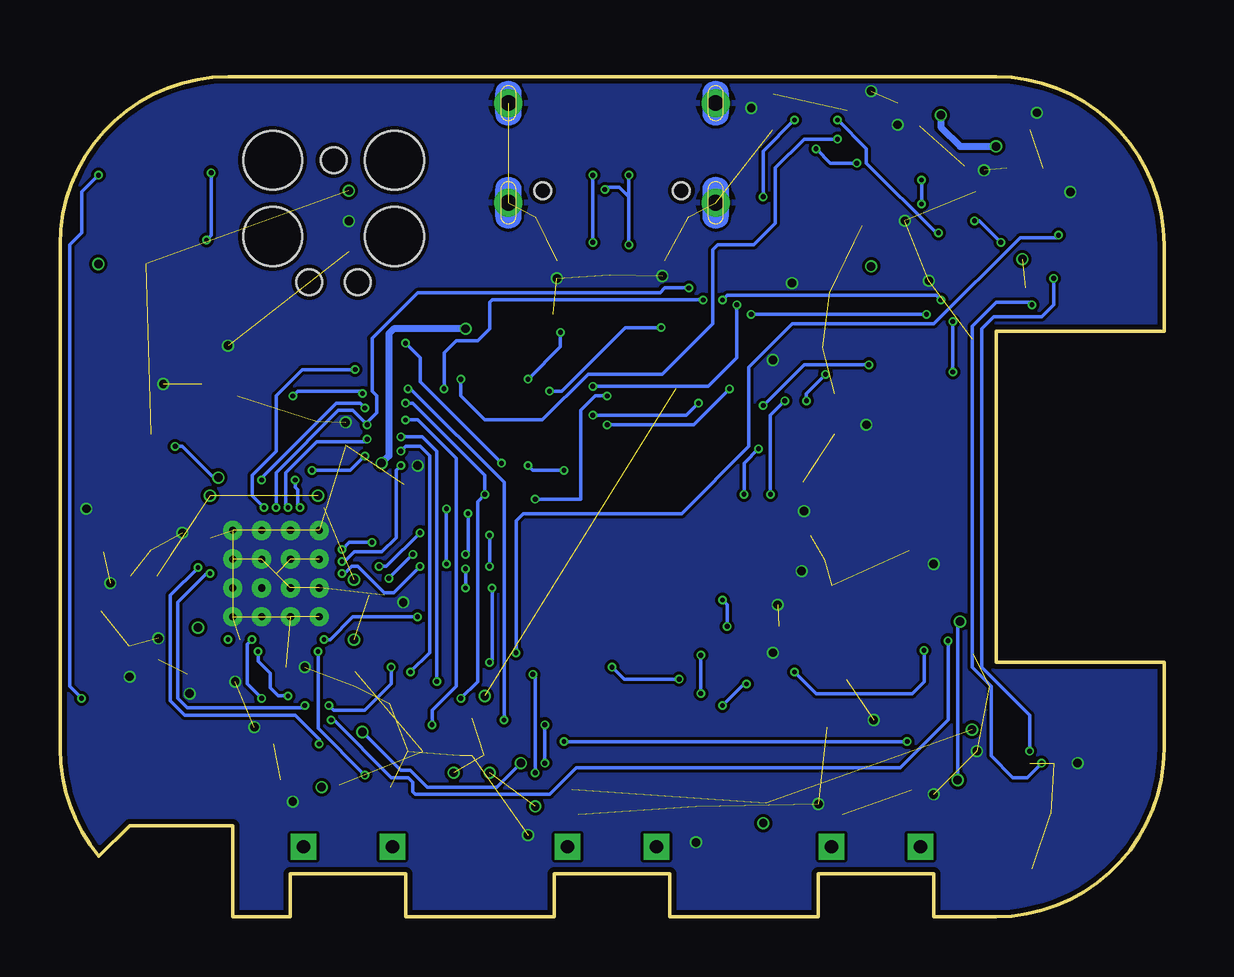
[diagram p5: board, bottom side, seen from below]

Size 46 x 35 mm. Coordinates in mm from the lower left corner, seen from the top.
Outline: 38.8,0 36.4,0 36.4,1.8 31.6,1.8 31.6,0 25.4,0 25.4,1.8 20.6,1.8 20.6,0 14.4,0 14.4,1.8 9.6,1.8 9.6,0 7,0 arc-90 0,7 0,10.6 7,10.6 7,24.4 0,24.4 0,28 arc-90 7,35 39,35 arc-90 46,28 46,7 arc-40 44.38,2.52 43.1,3.8 38.8,3.8 38.8,0
Copper layers (1+2*15+16): Top 0.035mm / dielectric 1.6mm / Route2 0.035mm / dielectric 0.15mm / Route15 0.035mm / dielectric 0.2mm / Bottom 0.035mm
Design rules "jlcpcb-2layers.dru *": minimum track width 5mil, minimum drill 0.2mm, track to track 5mil, track to pad 5mil, pad to pad 5mil, via to via 5mil, smd to smd 5mil, copper to edge 0.2mm, drill to drill 6mil, minimum pad ring 10mil, minimum via ring 3mil, stop-mask expansion 4mil, vias tented up to drill 999mm, thermal gap 10mil

### Footprints (pad centres in the part's own frame; a part is rotated, then mirrored left to right if it is on the bottom)
2450AT18B100E_ANTC3216X140N = smd 1.15 x 1.8: 1 -1.5,0; 2 1.5,0
NORDIC_NRF_3_RESC0201_N = smd 0.4 x 0.45: 1 -0.305,0; 2 0.305,0
NORDIC_NRF_3_RESC0402_N = smd 0.6 x 0.6: 1 -0.55,0; 2 0.55,0
GRM011R60J152KE01L_2_CAPC0201X13N = smd 0.22 x 0.23: 1 -0.185,0; 2 0.185,0
ESP32_C6_LIBRARY_5_SOD3716X135N = smd 1.15 x 0.8: 1 -1.75,0; 2 1.75,0
ESP32_C6_LIBRARY_3_SOT95P280X145-6N = smd 1.2 x 0.6: 1 -1.25,0.95; 2 -1.25,0; 3 -1.25,-0.95; 4 1.25,-0.95; 5 1.25,0; 6 1.25,0.95
BQ25180YBGR_BGA8C40P2X4_100X155X50 = smd 0.2 x 0.2: A1 -0.2,0.6; A2 0.2,0.6; B1 -0.2,0.2; B2 0.2,0.2; C1 -0.2,-0.2; C2 0.2,-0.2; D1 -0.2,-0.6; D2 0.2,-0.6
DRV2605YZFR_BGA9C50P3X3_144X144X62 = smd 0.25 x 0.25: A1 -0.5,0.5; A2 0,0.5; A3 0.5,0.5; B1 -0.5,0; B2 0,0; B3 0.5,0; C1 -0.5,-0.5; C2 0,-0.5; C3 0.5,-0.5
BMA423_BMA423 = smd 0.3 x 0.35: 1 -0.75,-0.775; 2 -0.25,-0.775; 3 0.25,-0.775; 4 0.75,-0.775; 7 0.75,0.775; 8 0.25,0.775; 9 -0.25,0.775; 10 -0.75,0.775 | smd 0.35 x 0.3: 5 0.775,-0.25; 6 0.775,0.25; 11 -0.775,0.25; 12 -0.775,-0.25
RT6160AWSC_BGA15C40P3X5_140X230X60 = smd 0.216 x 0.216: A1 -0.4,0.8; A2 0,0.8; A3 0.4,0.8; B1 -0.4,0.4; B2 0,0.4; B3 0.4,0.4; C1 -0.4,0; C2 0,0; C3 0.4,0; D1 -0.4,-0.4; D2 0,-0.4; D3 0.4,-0.4; E1 -0.4,-0.8; E2 0,-0.8; E3 0.4,-0.8
503480-2400_5034802400 = smd 0.3 x 0.7: 1 -5.75,1.525; 2 -5.25,1.525; 3 -4.75,1.525; 4 -4.25,1.525; 5 -3.75,1.525; 6 -3.25,1.525; 7 -2.75,1.525; 8 -2.25,1.525; 9 -1.75,1.525; 10 -1.25,1.525; 11 -0.75,1.525; 12 -0.25,1.525; 13 0.25,1.525; 14 0.75,1.525; 15 1.25,1.525; 16 1.75,1.525; 17 2.25,1.525; 18 2.75,1.525; 19 3.25,1.525; 20 3.75,1.525; 21 4.25,1.525; 22 4.75,1.525; 23 5.25,1.525; 24 5.75,1.525 | smd 0.3 x 1: MP1 -6.54,-1.125; MP2 6.54,-1.125
TC2030-IDC_TC2030IDC = smd 0.783 x 0.783: 1 -0.953,-0.635; 2 -0.953,0.635; 3 0.317,-0.635; 4 0.317,0.635; 5 1.588,-0.635; 6 1.588,0.635 | hole 2.451: -2.223,-2.54; -2.223,2.54; 0.952,-2.54; 0.952,2.54 | hole 1.067: -2.223,0; 2.857,-1.016; 2.857,1.016
KH-TYPE-C-16P_KINGHELM_KH-TYPE-C-16P = smd 0.6 x 1.15: A1_B12 -3.2,4.725; A4_B9 -2.4,4.725; A9_B4 2.4,4.725; A12_B1 3.2,4.725 | smd 0.3 x 1.15: A5 -1.25,4.725; A6 -0.25,4.725; A7 0.25,4.725; A8 1.25,4.725; B5 1.75,4.725; B6 0.75,4.725; B7 -0.75,4.725; B8 -1.75,4.725 | drill 0.65 pad 1.05: SH1 -4.32,0; SH2 4.32,0; SH3 -4.32,4.15; SH4 4.32,4.15 | hole 0.7: -2.89,3.65; 2.89,3.65
NORDIC_NRF_2_RESC0201_N = smd 0.4 x 0.45: 1 -0.305,0; 2 0.305,0
ESP32_C6_LIBRARY_2_IND_4828-WE-TPC_WRE = smd 0.9 x 5.3: 1 -2.286,0; 2 2.286,0
MLP2016SR47MT0S1_INDC2016X100N = smd 1.2 x 2.2: 1 -1.028,0; 2 1.028,0
ESP32_C6_LIBRARY_4_ESP32_C6_LIBRARY_4_ESP32_C6_LIBRARY_4_ESP32_C6_LIBRARY_4_ESP32_WROVER_SPARKFUN-DISCRETESEMI_SOT23-3 = smd 0.8 x 0.9: 1 -0.95,-1; 2 0.95,-1; 3 0,1.1
ESP32_C6_LIBRARY_6_SOT65P210X110-3N = smd 1.05 x 0.5: 1 -1.05,0.65; 2 -1.05,-0.65; 3 1.05,0
CPF0201D7K68C1_0201 = smd 0.35 x 0.25: 1 0,0.275; 2 0,-0.275
ESP32_C6_LIBRARY_7_JUMPER_SJ = smd 1.168 x 1.6: 1 -0.762,0; 2 0.762,0
2025-10-22_07-23-44_LIBRARY_SW_EVP-AKE31A_PAN = smd 0.711 x 1.092: 1 -1.4,-0.972; 2 1.4,-0.972 | drill 0.559 pad 0.914 square: 3 -1.848,0.381; 4 1.848,0.381 | smd 1.397 x 1.092: 5 0,-1.124
HECTOR_WATCH_1_TP20R = smd 2 x 2: TP 0,0
NORDIC_NRF_4_AQFN50P700X700X85_HS-74N = smd 4.85 x 4.85: P$74 0,0 | drill 0.3 pad 0.6: P$75 -1.8,1.8; P$76 -0.6,1.8; P$77 0.6,1.8; P$78 1.8,1.8; P$79 -1.8,0.6; P$80 -0.6,0.6; P$81 0.6,0.6; P$82 1.8,0.6; P$83 -1.8,-0.6; P$84 -0.6,-0.6; P$85 0.6,-0.6; P$86 1.8,-0.6; P$87 -1.8,-1.8; P$88 -0.6,-1.8; P$89 0.6,-1.8; P$90 1.8,-1.8 | smd 0.2 x 0.2: P$A8 -1.25,3.25; P$A10 -0.75,3.25; P$A12 -0.25,3.25; P$A14 0.25,3.25; P$A16 0.75,3.25; P$A18 1.25,3.25; P$A20 1.75,3.25; P$A22 2.25,3.25; P$A23 2.75,3.25; P$AA24 3.25,-2.25; P$AB2 -2.75,-2.5; P$AC5 -2,-2.75; P$AC9 -1,-2.75; P$AC11 -0.5,-2.75; P$AC13 0,-2.75; P$AC15 0.5,-2.75; P$AC17 1,-2.75; P$AC19 1.5,-2.75; P$AC21 2,-2.75; P$AC24 3.25,-2.75; P$AD2 -2.75,-3.25; P$AD4 -2.25,-3.25; P$AD6 -1.75,-3.25; P$AD8 -1.25,-3.25; P$AD10 -0.75,-3.25; P$AD12 -0.25,-3.25; P$AD14 0.25,-3.25; P$AD16 0.75,-3.25; P$AD18 1.25,-3.25; P$AD20 1.75,-3.25; P$AD22 2.25,-3.25; P$AD23 2.75,-3.25; P$B1 -3.25,2.75; P$B3 -2.5,2.75; P$B5 -2,2.75; P$B7 -1.5,2.75; P$B9 -1,2.75; P$B11 -0.5,2.75; P$B13 0,2.75; P$B15 0.5,2.75; P$B17 1,2.75; P$B19 1.5,2.75; P$B24 3.25,2.75; P$C1 -3.25,2.25; P$D2 -2.75,2; P$D23 2.75,2; P$E24 3.25,1.75; P$F2 -2.75,1.5; P$F23 2.75,1.5; P$G1 -3.25,1.25; P$H2 -2.75,1; P$H23 2.75,1; P$J1 -3.25,0.75; P$J24 3.25,0.75; P$K2 -2.75,0.5; P$L1 -3.25,0.25; P$L24 3.25,0.25; P$M2 -2.75,0; P$N1 -3.25,-0.25; P$N24 3.25,-0.25; P$P2 -2.75,-0.5; P$P23 2.75,-0.5; P$R1 -3.25,-0.75; P$R24 3.25,-0.75; P$T2 -2.75,-1; P$T23 2.75,-1; P$U1 -3.25,-1.25; P$U24 3.25,-1.25; P$V23 2.75,-1.5; P$W1 -3.25,-1.75; P$W24 3.25,-1.75; P$Y2 -2.75,-2; P$Y23 2.75,-2
ESP32_C6_LIBRARY_SON50P200X200X80-9N = smd 0.76 x 0.27: 1 -0.985,0.75; 2 -0.985,0.25; 3 -0.985,-0.25; 4 -0.985,-0.75; 5 0.985,-0.75; 6 0.985,-0.25; 7 0.985,0.25; 8 0.985,0.75 | smd 0.9 x 1.3: 9 0,0
NORDIC_NRF_BT-XTAL_2016_N = smd 0.95 x 0.85: 1 -0.725,-0.575; 2 0.725,-0.575; 3 0.725,0.575; 4 -0.725,0.575
NORDIC_NRF_1_XTAL_3215_N = smd 1 x 1.8: 1 -1.25,0; 2 1.25,0

### Placement (x,y rotation side)
ANT1  41.2,3.8 270 top
C1  41.9,10.4 90 top
C1-EP-DR  14.5,18.1 0 top
C2  41.9,12.8 270 top
C2-EP-DR  17.3,12.2 270 top
C3  36.7,8.2 0 top
C4  37.1,6.9 90 top
C5  41.3,20.5 90 top
C6  35.3,20.1 90 top
C7  32.8,13.4 180 top
C8  33.7,9.9 270 top
C9  36.9,10.4 180 top
C10  43.9,15.2 0 top
C11  40.4,10.1 0 top
C12  42.2,20.4 90 top
C13  41.9,15.3 0 top
C14  42.5,14.2 0 top
C15  43.7,16.2 0 top
C16  43.6,17.3 0 top
C17  40.1,21.9 270 top
C18  38.3,21.7 0 top
C19  31.2,6.9 0 top
C20  34.1,19.1 90 top
C21  32.2,18 180 top
C22  36.5,5.7 0 top
C23  8.5,31.3 0 top
C24  8.4,30.2 0 top
C25  13.4,26 0 top
C27  5.6,32.6 270 top
C29  32.4,5.4 0 top
C30  10.7,5.3 0 top
C31  19.7,4.6 0 top
C32  4.9,4.3 0 top
C33  11.1,26 180 top
C34  7.1,9.6 180 top
C37  11.1,34.1 90 top
C38  16.3,32.6 270 top
C39  10.2,32.4 90 top
C42  26.2,27 180 top
C43  26,25.1 180 top
D2  21.3,11.8 0 top
D3  23.1,25.5 270 top
D4  15.8,7.9 0 top
D5  21.3,8 0 top
EPD_C1  13.2,21.8 180 top
EPD_C2  13.7,23.7 180 top
EPD_C5  13.2,17 180 top
EPD_C6  14.2,15.9 180 top
EPD_C7  13.6,14.9 180 top
EPD_C8  13.3,13.8 180 top
EPD_C9  13.3,12.7 180 top
EPD_C10  15.5,12.1 180 top
EPD_C11  13.1,11.3 180 top
EPD_C12  12.7,9.9 180 top
IC1  13.4,33 180 top
IC2  5.1,6.4 180 top
IC3  29.1,7.5 180 top
IC9  12.2,28.8 0 top
J1  9.1,17.5 270 top
J2  34.6,29.3 270 top
J4  23,33.9 180 top
L1  36.1,6.9 270 top
L2  41.5,17.7 270 top
L3  43.3,18.7 90 top
L5  21.3,16.5 90 top
L7  14.7,28.7 270 top
Q1  21.3,21 180 top
Q3  17,15.3 270 top
R1_EP_DR  15.2,22.6 0 top
R1_USB  25.3,27.6 180 top
R2  9.1,27.7 90 top
R2_EP_DR  17.3,21.5 0 top
R2_USB  20.8,27.6 0 top
R3  32,8.9 270 top
R4  9.1,29.1 90 top
R5  16.6,5 0 top
R7  34.1,5.5 90 top
R8  24.4,5.3 90 top
R9  16,34.3 270 top
R17  5,27.4 270 top
R18  5.5,26.2 270 top
R_PWR_EPD  19.1,23.3 270 top
R_TYPE_SEL  16.3,22.2 0 top
SJ1  14.5,20.1 0 top
SW_DN  34,3.3 180 top
SW_ENT  23,3.3 180 top
SW_UP  12,3.3 180 top
TP_3.3V  4.3,9.2 0 top
TP_3V3  42.4,27.2 0 top
TP_BAT_GND  28.5,2.1 180 top
TP_GND  5.5,2 0 top
TP_ON  2.2,7.5 90 top
TP_OP  2.2,5.3 90 top
TP_RESET  43.1,24 0 top
TP_SCL  1.9,29.3 0 top
TP_SDA  1.6,26.3 0 top
TP_SWDCLK  42.4,30.1 0 top
TP_SWDIO  41.6,32.8 0 top
TP_SWO  28.7,12.3 270 top
TP_VBAT  3.5,32.1 0 top
TP_VREG  7.3,33.7 0 top
U1  37,14.3 270 top
U3  5.8,30.2 270 top
X1  43.7,12 90 top
X2  38.8,19.9 180 top

### Tracks (layer width: path | path; a pad name or v marks a point on that pad's centre or on a via)
3V3  (via drill 0.35)  (15 unrouted)
  Top 0.3: R7.2 35,5.5 v35.1,5.4 | IC3.7 28.35,6.25 v28.1,6 | IC3.3 28.85,8.85 28.5,9.2 v28.3,9.2 | v29.6,6 29.85,6.25 IC3.10 30.72,6.72 C19.1 | IC9.E3 12.6,27.5 v12.2,27.1 | IC9.E2 v12.2,27.1 | R17.1 v5.9,27.4 | 5.11,6.91 IC2.C2 5.1,7.5 | R8.2 25.5,5.3 v26.2,4.6 | TP_3.3V.TP 5.1,8.4 5.1,7.5 | C6.1 35,19.25 35,17.8 U1.P$W1 35,17.3 U1.P$Y2 | C12.1 42.2,19.8 40.05,17.65 39.85,17.65 U1.P$B1 | v44.4,27.2 TP_3V3.TP | C14.1 40.8,13.05 40.8,12.1 40.75,12.05 U1.P$A22 | U1.P$AD14 33.55,14.05 33.11,13.6 C7.1 | U1.P$AD23 33.75,10.25 C8.1 | R18.1 8.57,26.2 9.47,27.1 v12.2,27.1 | Q1.2 19.52,22 18.82,22.7 R_PWR_EPD.2 18.1,23.3 16.3,25.1 13,25.1 12.85,25.25 C25.1 12.85,26.85 12.6,27.1 v12.2,27.1 | v8,7.8 5.6,7.8 | 5.6,7.8 5.4,7.8 5.1,7.5 | R5.2 16.7,4.62 v16.7,3.9 | 5.6,7.8 6.1,8.3 6.1,9.4 6.3,9.6 C34.2 | C33.1 12.2,26.55 v12.2,27.1
  other vias: 40.25,12.05 39.75,17.55 35.25,17.55 33.75,14.05 33.75,11.55 33.97,30.25
  pour Route15: 31.76,1.66 31.78,1.68 36.22,1.68 36.24,1.66 36.26,1.64 36.28,1.62 36.28,-0.22 38.7,-0.22 39.53,-0.18 40.35,-0.04 41.15,0.19 41.92,0.51 42.65,0.91 43.33,1.4 43.95,1.95 44.5,2.57 44.99,3.25 45.39,3.98 45.71,4.75 45.94,5.55 46.08,6.37 46.12,7.2 46.12,27.9 46.08,28.71 45.94,29.51 45.72,30.29 45.41,31.03 45.02,31.74 44.55,32.4 44.01,33.01 43.4,33.55 42.74,34.02 42.03,34.41 41.29,34.72 40.51,34.94 39.71,35.08 38.9,35.12 6.5,35.12 5.73,35.08 4.96,34.94 4.22,34.71 3.51,34.39 2.85,33.99 2.24,33.51 1.69,32.96 1.21,32.35 0.81,31.69 0.49,30.98 0.26,30.24 0.12,29.47 0.08,28.7 0.08,28.58 0.06,28.56 0.04,28.54 0.02,28.52 -0.12,28.52 -0.12,24.28 6.82,24.28 6.84,24.26 6.86,24.24 6.88,24.22 6.88,10.78 6.86,10.76 6.84,10.74 6.82,10.72 -0.12,10.72 -0.12,7.2 -0.08,6.39 0.06,5.59 0.28,4.81 0.59,4.07 0.98,3.36 1.45,2.7 1.99,2.09 2.6,1.55 3.26,1.08 3.97,0.69 4.71,0.38 5.49,0.16 6.29,0.02 7.1,-0.02 9.62,-0.02 9.62,1.72 9.64,1.74 9.66,1.76 9.68,1.78 14.32,1.78 14.34,1.76 14.36,1.74 14.38,1.72 14.38,-0.02 20.62,-0.02 20.62,1.72 20.64,1.74 20.66,1.76 20.68,1.78 25.32,1.78 25.34,1.76 25.36,1.74 25.38,1.72 25.38,-0.12 31.72,-0.12 31.72,1.62 31.74,1.64
ALERT  (via drill 0.2)
  Top 0.15: v32.2,10.4 31.6,11 v27,11 | v4.4,28.4 5.05,29.05 U3.5 | v36.5,9.2 35.2,9.2 v34.8,8.8
  Bottom 0.15: v34.8,8.8 34.6,8.6 33.3,8.6 32.2,9.7 v32.2,10.4 | v27,11 27,16.5 26.7,16.8 20.1,16.8 17.3,19.6 17.3,22.9 15.5,24.7 9.6,24.7 6,28.3 4.5,28.3 v4.4,28.4 | v36.5,9.2 36.9,9.2 37.25,9.55 37.25,10.15 37.75,10.65 U1.P$J24
  other vias: 37.75,11.05
D+  (via drill 0.2)
  Top 0.15: U1.P$AD6 33.55,16.05 33.2,16.4 31.1,16.4 v25.6,21.9 | D3.4 21.25,24.25 v20.95,24.55
  Bottom 0.15: v25.6,21.9 25.1,21.9 22.45,24.55 v20.95,24.55
D-  (via drill 0.2)
  Top 0.15: U1.P$AD4 33.45,16.55 33.1,16.9 31.6,16.9 30.81,17.69 arc90 30.66,17.69 arc-90 30.51,17.69 30.33,17.87 arc-90 30.33,18.02 30.41,18.11 arc90 30.41,18.26 30.23,18.44 arc90 30.08,18.44 30,18.35 arc-90 29.85,18.35 29.66,18.54 arc-90 29.66,18.68 29.82,18.84 arc90 29.82,18.98 29.63,19.16 arc90 29.48,19.16 29.34,19.02 arc-90 29.18,19.02 29,19.2 arc-90 29,19.35 29.15,19.5 arc90 29.15,19.65 28.97,19.83 arc90 28.82,19.83 28.67,19.68 arc-90 28.52,19.68 28.34,19.86 arc-90 28.34,20.01 28.49,20.16 arc90 28.49,20.31 28.31,20.49 arc90 28.16,20.49 28.01,20.34 arc-90 27.86,20.34 27.68,20.52 arc-90 27.68,20.67 27.83,20.82 arc90 27.83,20.97 27.65,21.15 arc90 27.5,21.15 27.35,21 arc-90 27.2,21 27.02,21.18 arc-90 27.02,21.33 27.17,21.48 arc90 27.17,21.63 26.99,21.81 arc90 26.84,21.81 arc-90 26.69,21.81 26.6,21.9 26.6,22.3 v26.5,22.4 | v25.15,24.35 25.05,24.25 D3.6
  Bottom 0.15: v26.5,22.4 25.15,23.75 v25.15,24.35
DN  (via drill 0.2)
  Top 0.15: D3.1 24.05,27.85 v23.8,28.1 | J4.B7 23.8,29.23 v23.8,30.9 23.3,30.9 22.75,30.35 J4.A7
  Bottom 0.15: v23.8,28.1 v23.8,30.9
DP  (via drill 0.2)
  Top 0.15: 22.3,29.12 J4.B6 22.25,30.85 v22.3,30.9 | 21.9,27 D3.3 22.15,27.85 v22.3,28 | v23.3,30.3 23.3,29.23 J4.A6
  Bottom 0.15: v22.3,30.9 22.3,30 | 22.3,30 v22.3,28 | v23.3,30.3 23.2,30.4 22.7,30.4 22.3,30
EPD_3V3
  Top 0.3: J1.16 J1.15 11.3,16.25 12.05,17 EPD_C5.2 12.65,17.75 13.1,18.2 13.85,18.2 C1-EP-DR.1 13.95,18.4 14.35,18.8 21.29,18.8 L5.2 Q1.3
EPD_BUSY  (via drill 0.2)
  Top 0.15: J1.9 9.55,19.25 9.5,19.3 9.5,23.6 10.3,24.4 15.8,24.4 18.1,22.1 v18.1,22 | v25,18.6 25,18.7 v23.2,20.5 | U1.P$AD12 33.25,14.55 32.8,14.1 v32.3,14.1 | v31.3,15.1 30.8,15.1 30.7,15.2 29.2,15.2 v29.1,15.1 | v29,16.8 28.5,16.8 v26.5,18.8
  Bottom 0.15: v18.1,22 19.6,20.5 v23.2,20.5 | v26.5,18.8 26.3,18.6 v25,18.6 | v32.3,14.1 v31.3,15.1 | v29,16.8 29,15.2 v29.1,15.1
EPD_CS  (via drill 0.2)
  Top 0.15: v33.7,22.8 21.4,22.8 19.1,25.1 v17.2,25.1 | v9.9,25.1 9.9,25 8,23.1 8,18.2 8.45,17.75 J1.12
  Bottom 0.15: v33.7,22.8 35.9,22.8 37,21.7 37,19.4 38,18.4 38,17.55 U1.P$K2 | v17.2,25.1 v9.9,25.1
  other vias: 37.5,17.05
EPD_DC  (via drill 0.2)
  Top 0.15: J1.11 8.95,18.25 8.3,18.9 8.3,23 10,24.7 16,24.7 19.3,21.4 v19.4,21.4 | v23.8,20.9 27.55,17.15 27.55,16.75 28,16.3 30.7,16.3 v31,16 | v32.7,14.6 33.1,15 33.7,15 U1.P$AD10
  Bottom 0.15: v23.8,20.9 19.9,20.9 v19.4,21.4 | v32.7,14.6 32.4,14.6 v31,16
EPD_RST  (via drill 0.2)
  Top 0.15: v31.8,18.8 31.1,19.5 31.1,21.9 30.9,22.1 30.1,22.1 v30,22 | v9.3,25.7 8.8,25.2 v8.8,24.8 | v8.8,22.7 8.8,19.4 9.45,18.75 J1.10 | v19.2,25.7 v18.4,25.7
  Bottom 0.15: U1.P$AC11 34.15,14.8 33.75,15.2 32.6,15.2 32,15.8 32,18.6 v31.8,18.8 | v30,22 30,23.5 29.5,24 28.6,24 28.1,24.5 28.1,25.6 28,25.7 v19.2,25.7 | v8.8,24.8 v8.8,22.7 | v18.4,25.7 18.2,25.9 9.5,25.9 v9.3,25.7
  other vias: 34.25,14.8
GDR  (via drill 0.2)
  Top 0.15: v16.7,21.3 17.23,21.3 R2_EP_DR.2 17.3,20.93 16.95,20.57 16.95,19.55 v16.9,19.5 | v12.3,23 12.1,22.8 10.68,22.8 J1.2 | v17.5,17.6 17.6,17.5 17.6,16.4 Q3.1
  Bottom 0.15: v16.7,21.3 15,23 v12.3,23 | v16.9,19.5 17.5,18.9 v17.5,17.6
GND  (via drill 0.35)  (76 unrouted)
  Top 0.3: C20.2 v34.1,20.6 | IC9.C3 IC9.C2 IC9.C1 IC9.B1 11.6,29 v10.8,29 | U3.9 5.65,30.05 | 5.65,30.05 5.55,29.95 U3.6 | U3.1 6.55,30.75 6,30.2 U3.9 | U3.4 5.05,30.65 5.65,30.05 | U3.9 v3.9,30.2 | C27.1 5.6,33.2 v5.3,33.5 | C39.2 10.25,33 v11.1,33 C37.1 | C23.1 7.7,31.3 v7.5,31.1 7.85,30.75 C24.1 | C30.1 9.8,5.3 v9.6,5.1 | SW_UP.1 13.83,4.7 v14.4,4.7 | C31.1 19.52,3.12 v19.5,3.1 | SW_ENT.1 25.63,4.27 v26.5,3.4 27.8,2.1 TP_BAT_GND.TP | C21.2 31.1,18.55 v31.1,18.8 | IC1.D2 13.2,34.4 13.1,34.5 12.3,34.5 v12.2,34.4 | C33.2 10.05,26.5 v9.8,26.5 | C7.2 32.2,13.1 v31.7,13.1 | R_TYPE_SEL.1 v16.3,23.2 | R2_EP_DR.1 17.3,22.3 16.4,23.2 v16.3,23.2 | EPD_C2.1 15.8,23.7 v16.3,23.2 | C25.2 15.1,26 v15.5,26.4 | v44.9,17 44.6,17.3 C16.2 | C15.2 44.9,16.85 v44.9,17 | C10.2 45.1,15.2 45.2,15.3 45.2,16.7 v44.9,17 | R2_USB.2 20.9,27.23 v20.9,26.7 | R9.1 16.6,34.3 v17.2,33.7 | C38.1 16.79,32.78 17.2,33.2 v17.2,33.7 | J4.SH2 17.4,33.9 v17.2,33.7 | R1_USB.1 v25.3,26.6 25.62,26.6 C42.2 | C9.2 v35.8,10.4 | EPD_C1.1 13.74,21.79 SJ1.1 12.8,20.1 v12.4,20.5 11.65,19.75 J1.8 | J2.5 J2.3 | EPD_C8.1 15.6,13.8 16.1,13.3 v16.1,13 16,12.9 14.4,12.9 14.2,12.7 EPD_C9.1 | EPD_C10.1 16.25,11.9 16.25,11.05 v16.3,11 15.2,11 | 15.2,11 13.95,11 EPD_C11.1 | EPD_C12.1 14.1,9.9 15.2,11 | C1-EP-DR.2 15.2,17.95 15.2,17.1 v15,16.9 | v15,16.9 14.9,17 EPD_C5.1 | v15,16.9 15,16.15 EPD_C6.1 | v15.1,14.4 14.6,14.9 EPD_C7.1 | J1.17 10.15,15.25 v9.6,14.7 | D4.1 12.4,7.9 v12.1,8.2 | X1.4 43.12,10.03 v43.1,10 | C11.2 40.7,9.4 v40.6,9.3 | C14.2 43.6,14.2 v43.9,13.9 44.27,13.53 X1.2 | C2.2 v41.9,11.6 C1.2 | IC2.B1 7.3,6.4 v7.8,6.9 | C3.2 37.6,8.2 v37.9,7.9 37.2,7.21 C4.2 | SW_DN.1 35.93,4.8 v36.3,4.8 36.8,5.3 C22.2
  Top 0.3: U1.P$F23 38.5,11.4 38.3,11.2 38.3,10.2 v38.7,9.8 | U1.P$74 U1.P$81 | C18.2 39,22.09 v39,23.8 39.61,23.8 40.1,23.3 C17.1 | C5.2 41.3,21.8 v41.7,22.2 42.2,21.7 C12.2 | U1.P$B7 39.85,15.8 40.05,16 v40.9,16 | IC2.B3 v3.6,6.4
  other vias: 33.97,28.98
  pour Top: 20.66,1.76 20.68,1.78 25.32,1.78 25.34,1.76 25.36,1.74 25.38,1.72 25.38,-0.02 31.62,-0.02 31.62,1.72 31.64,1.74 31.66,1.76 31.68,1.78 36.32,1.78 36.34,1.76 36.36,1.74 36.38,1.72 36.38,-0.02 38.7,-0.02 39.53,0.02 40.35,0.16 41.15,0.39 41.92,0.71 42.65,1.11 43.33,1.6 43.95,2.15 44.5,2.77 44.99,3.45 45.39,4.18 45.71,4.95 45.94,5.75 46.08,6.57 46.12,7.4 46.12,28.3 46.07,29.11 45.93,29.91 45.69,30.68 45.35,31.42 44.93,32.12 44.43,32.76 43.86,33.33 43.22,33.83 42.52,34.25 41.78,34.59 41.01,34.83 40.21,34.97 39.4,35.02 7.4,35.02 6.57,34.98 5.75,34.84 4.95,34.61 4.18,34.29 3.45,33.89 2.77,33.4 2.15,32.85 1.6,32.23 1.11,31.55 0.71,30.82 0.39,30.05 0.16,29.25 0.02,28.43 -0.02,27.6 -0.02,24.38 6.92,24.38 6.94,24.36 6.96,24.34 6.98,24.32 6.98,10.68 6.96,10.66 6.94,10.64 6.92,10.62 -0.02,10.62 -0.02,7.1 0.02,6.3 0.15,5.51 0.38,4.75 0.68,4.01 1.07,3.31 1.53,2.66 2.06,2.06 2.66,1.53 3.31,1.07 4.01,0.68 4.75,0.38 5.51,0.15 6.3,0.02 7.1,-0.02 9.62,-0.02 9.62,1.72 9.64,1.74 9.66,1.76 9.68,1.78 14.32,1.78 14.34,1.76 14.36,1.74 14.38,1.72 14.38,-0.02 20.62,-0.02 20.62,1.72 20.64,1.74
  pour Route2: 31.56,1.86 31.58,1.88 36.42,1.88 36.44,1.86 36.46,1.84 36.48,1.82 36.48,0.08 39,0.08 39.78,0.12 40.54,0.25 41.29,0.46 42,0.76 42.68,1.14 43.32,1.59 43.9,2.1 44.41,2.68 44.86,3.32 45.24,4 45.54,4.71 45.75,5.46 45.88,6.22 45.92,7 45.92,28 45.88,28.78 45.75,29.54 45.54,30.29 45.24,31 44.86,31.68 44.41,32.32 43.9,32.9 43.32,33.41 42.68,33.86 42,34.24 41.29,34.54 40.54,34.75 39.78,34.88 39,34.92 7,34.92 6.22,34.88 5.46,34.75 4.71,34.54 4,34.24 3.32,33.86 2.68,33.41 2.1,32.9 1.59,32.32 1.14,31.68 0.76,31 0.46,30.29 0.25,29.54 0.12,28.78 0.08,28 0.08,24.48 7.02,24.48 7.04,24.46 7.06,24.44 7.08,24.42 7.08,10.58 7.06,10.56 7.04,10.54 7.02,10.52 0.08,10.52 0.08,7 0.12,6.22 0.25,5.46 0.46,4.71 0.76,4 1.14,3.32 1.59,2.68 2.1,2.1 2.68,1.59 3.32,1.14 4,0.76 4.71,0.46 5.46,0.25 6.22,0.12 7,0.08 9.52,0.08 9.52,1.82 9.54,1.84 9.56,1.86 9.58,1.88 14.42,1.88 14.44,1.86 14.46,1.84 14.48,1.82 14.48,0.08 20.52,0.08 20.52,1.82 20.54,1.84 20.56,1.86 20.58,1.88 25.42,1.88 25.44,1.86 25.46,1.84 25.48,1.82 25.48,0.08 31.52,0.08 31.52,1.82 31.54,1.84
  pour Bottom: 7.06,10.56 7.04,10.54 7.02,10.52 0.08,10.52 0.08,7 0.12,6.22 0.25,5.46 0.46,4.71 0.76,4 1.14,3.32 1.59,2.68 2.1,2.1 2.68,1.59 3.32,1.14 4,0.76 4.71,0.46 5.46,0.25 6.22,0.12 7,0.08 9.52,0.08 9.52,1.82 9.54,1.84 9.56,1.86 9.58,1.88 14.42,1.88 14.44,1.86 14.46,1.84 14.48,1.82 14.48,0.08 20.52,0.08 20.52,1.82 20.54,1.84 20.56,1.86 20.58,1.88 25.42,1.88 25.44,1.86 25.46,1.84 25.48,1.82 25.48,0.08 31.52,0.08 31.52,1.82 31.54,1.84 31.56,1.86 31.58,1.88 36.42,1.88 36.44,1.86 36.46,1.84 36.48,1.82 36.48,0.08 39,0.08 39.78,0.12 40.54,0.25 41.29,0.46 42,0.76 42.68,1.14 43.32,1.59 43.9,2.1 44.41,2.68 44.86,3.32 45.24,4 45.54,4.71 45.75,5.46 45.88,6.22 45.92,7 45.92,28 45.88,28.78 45.75,29.54 45.54,30.29 45.24,31 44.86,31.68 44.41,32.32 43.9,32.9 43.32,33.41 42.68,33.86 42,34.24 41.29,34.54 40.54,34.75 39.78,34.88 39,34.92 7,34.92 6.22,34.88 5.46,34.75 4.71,34.54 4,34.24 3.32,33.86 2.68,33.41 2.1,32.9 1.59,32.32 1.14,31.68 0.76,31 0.46,30.29 0.25,29.54 0.12,28.78 0.08,28 0.08,24.48 7.02,24.48 7.04,24.46 7.06,24.44 7.08,24.42 7.08,10.58
HAPTIC_EN  (via drill 0.2)
  Top 0.15: U1.P$U1 35.75,18.35 v35.5,18.6 | v33.3,19.2 33.1,19.4 v31.8,19.4 | v31.4,10.2 27,10.2 26.3,9.5 26.3,7.5 26.1,7.3 v25,7.3 | IC2.A1 7.78,5.9 9.03,7 9.33,7.3 v10.7,7.3
  Bottom 0.15: v35.5,18.6 33.9,18.6 v33.3,19.2 | v31.8,19.4 31.6,19.6 31,19.6 30.6,19.2 30.6,11 v31.4,10.2 | v25,7.3 v10.7,7.3
IMU_INT1  (via drill 0.2)
  Top 0.15: IC3.5 27.95,7.75 v27.5,8.2 | v33.4,21.8 33.2,22 v31.5,22 | v36.3,21.7 36.75,21.25 U1.P$N1
  Bottom 0.15: v27.5,8.2 27.5,18.1 31.4,22 v31.5,22 | v36.3,21.7 36.1,21.9 33.5,21.9 v33.4,21.8
IMU_INT2  (via drill 0.2)
  Top 0.15: v33.2,19.9 32.1,19.9 32,20 v31.8,20 | v30.3,9.8 27.2,9.8 26.7,9.3 26.7,7.5 26.95,7.25 IC3.6
  Bottom 0.15: U1.P$P2 36.6,17.15 36.6,18.5 35.3,19.8 33.3,19.8 v33.2,19.9 | v31.8,20 30.9,20 30.3,19.4 v30.3,9.8
  other vias: 36.5,17.05
LX1
  Top 0.15: L7.1 14.17,29.2 IC9.B3 IC9.B2
LX2
  Top 0.15: L7.2 14.03,27.67 13.3,28.4 IC9.D3 IC9.D2
MOSI  (via drill 0.2)
  Top 0.15: v35.8,8.8 35.2,8.2 v34.7,8.2 | v9,11.5 9,16 9.8,16.8 10.57,16.8 J1.14
  Bottom 0.15: U1.P$B13 39.9,14.3 41.1,13.1 41.1,9.1 40.7,8.7 35.9,8.7 v35.8,8.8 | v34.7,8.2 34.6,8.2 32.2,5.8 31.5,5.8 31.3,5.6 31.3,5.2 31.2,5.1 25.6,5.1 24.5,6.2 11,6.2 9,8.2 v9,11.5
  other vias: 39.75,14.3
N$2
  Top 0.15: R9.2 14.3,34.3 IC1.D1
N$5
  Top 0.15: IC9.D1 10.07,28.4 R4.2
N$6
  Top 0.15: R2.2 9.68,28 IC9.E1
N$8
  Top 0.15: R3.2 31.3,8.47 30.05,8.47 IC3.1
N$9
  Top 0.15: C9.1 37.2,10.6 U1.P$N24
N$10  (via drill 0.2 pad 0.15)
  Top 0.15: L1.1 36.4,7.51 36.4,7.8 36.39,7.81 C3.1 36.4,8.6 36.5,8.7 37.2,8.7 v37.6,9.1
  Bottom 0.15: v37.6,9.1 38.2,9.7 38.2,11.35 U1.P$H23
  other vias: 38,11.55
N$11  (via drill 0.2 pad 0.15)
  Top 0.15: U1.P$D23 39.4,11.15 39.4,10.3 39.6,10.1 C11.1
  other vias: 39,11.55
N$12
  Top 0.15: L3.1 C16.1 43.15,17.16 C15.1 42.85,16.5 39.95,16.5 U1.P$B5
  Top 0.152: C15.1 43.3,16.05 43.3,15.5 C10.1 43.7,15.1 43.7,14.9 45.3,13.29 45.3,10.1 44,8.8 39.7,8.8 39.35,9.15 39.35,9.95 38.75,10.55 U1.P$E24
N$13
  Top 0.15: X1.3 42.75,13.11 C2.1 | C2.1 41.9,13.06 | U1.P$A23 40.85,11.55 41.2,11.9 41.2,12.9 41.4,13.1 C2.1
N$14
  Top 0.15: U1.P$B24 40.11,10.7 41,10.7 41.6,10.09 C1.1 42.1,10.09 42.8,9.4 43.77,9.4 44.4,10.03 44.4,11.15 X1.1
N$15
  Top 0.15: C13.1 41.5,15.3 40.7,14.5 40.7,13.5 U1.P$A18
N$16
  Top 0.15: L3.2 42.5,19 L2.1
N$17
  Top 0.15: L2.2 40.91,16.8 U1.P$B3
N$18  (via drill 0.2 pad 0.15, 0.35)
  Top 0.15: C5.1 41.3,19.7 v41.2,19.6 | U1.P$C1 39.25,18.15 v39.4,18.3
  Bottom 0.15: v39.4,18.3 39.6,18.3 40.9,19.6 v41.2,19.6
N$19
  Top 0.15: U1.P$D2 38.9,17.15 38.9,18.75 X2.1 40.05,21.55 C17.2
N$20
  Top 0.15: U1.P$F2 38.6,17.15 38.6,18.85 X2.2 37.55,21.25 C18.1
N$21
  Top 0.15: U1.P$AC5 34.15,16.4 34.15,18.5 C20.1
N$22
  Top 0.15: IC2.A2 5.09,5.88 C32.2
N$23
  Top 0.15: R1_USB.2 24.88,28.3 24.4,28.3 24.25,28.45 J4.A5
N$24
  Top 0.15: R2_USB.1 21.15,28.23 21.15,29.07 J4.B5
N$25  (via drill 0.2)
  Top 0.15: v18.2,12.1 17.75,11.65 C2-EP-DR.2 17.3,11.1 18,10.4 22.2,10.4 23.05,9.55 D5.2 | v18.4,13.2 20.29,13.2 L5.1
  Top 0.152: Q3.3 18.05,13.2 v18.4,13.2
  Bottom 0.15: v18.2,12.1 18.2,13 v18.4,13.2
N$26  (via drill 0.2)
  Top 0.15: C2-EP-DR.1 18.6,12.75 D2.1 19.55,11.15 v19.3,10.9 | D4.2 17.55,8.9 17.95,9.3 v19.3,9.3
  Bottom 0.15: v19.3,9.3 v19.3,10.9
N$27
  Top 0.15: R_TYPE_SEL.2 16.25,21.93 15.3,22.88 R1_EP_DR.1 15.14,22.88 14.4,22.14 14.4,21.4 15.1,20.7 15.1,20.26 SJ1.2
N$29
  Top 0.15: EPD_C2.2 12.85,24 10.3,24 9.9,23.6 9.9,22.1 10.25,21.75 J1.4
N$30
  Top 0.15: EPD_C1.2 12.1,21.25 J1.5
N$31
  Top 0.15: EPD_C6.2 12.65,15.9 11.5,14.75 J1.18
N$32
  Top 0.15: EPD_C7.2 12.65,14.9 12,14.25 J1.19
N$33
  Top 0.15: EPD_C8.2 12.6,13.65 10.72,13.65 J1.20
N$35
  Top 0.15: EPD_C10.2 14.85,12 12.2,12 11.45,12.75 J1.22
N$37
  Top 0.15: EPD_C12.2 12.15,10.22 J1.24
OUT+
  Top 0.15: IC2.A3 2.8,5.9 TP_OP.TP
OUT-
  Top 0.15: IC2.C3 2.8,6.9 TP_ON.TP
P0.13  (via drill 0.2)
  Top 0.15: SW_UP.2 10.88,4.56 C30.2 15.78,5.3 R5.1 16.6,5.3 17.2,5.9 23.7,5.9 24.2,6.4 v25.8,6.4 | U1.P$AD8 33.65,15.55 33.2,16 32.5,16 32,15.5 28.6,15.5 28.2,15.9 v28.1,15.9 | v28.1,14.6 25.8,12.3 v25.8,8
  Bottom 0.15: v28.1,15.9 v28.1,14.6 | v25.8,8 v25.8,6.4
P0.14  (via drill 0.2)
  Top 0.15: SW_ENT.2 21.27,4.6 C31.2 20.68,5.4 24.12,5.4 | v28.1,10.6 26.8,10.6 v26.3,10.1 | v28,13.7 28,13.9 28.2,14.1 31.1,14.1 32.6,15.6 v33,15.6 | 24.12,5.4 24.73,6 v26.2,6 | R8.1 24.12,5.4
  Bottom 0.15: v26.3,10.1 26.2,10 v26.2,6 | v28,13.7 28,10.7 v28.1,10.6 | v33,15.6 33.95,15.6 U1.P$AC9
  other vias: 34.25,15.3
P1.01  (via drill 0.2)
  Top 0.15: v31.1,12.5 31.1,13.2 30.6,13.7 v29.1,13.7 | v29.1,14.5 28.8,14.5 26.2,17.1 v26.2,17.4 | v23.2,21.7 22.9,22 Q1.1 21.8,22 20.5,23.3 R_PWR_EPD.1
  Bottom 0.15: U1.P$Y23 34.75,11.55 33.8,12.5 v31.1,12.5 | v29.1,14.5 v29.1,13.7 | v26.2,17.4 24.3,17.4 24.3,21.1 23.7,21.7 v23.2,21.7
  other vias: 35,11.55
P1.02  (via drill 0.2 pad 0.15)
  Top 0.15: SW_DN.2 32.6,5.38 C29.2 33.73,5.4 R7.1 33.42,5.9 v33.3,5.9
  Bottom 0.15: v33.3,5.9 35.25,7.85 U1.P$W24
  other vias: 35.25,11.05
PMIC_INT  (via drill 0.2)
  Top 0.15: v36.2,18.2 36.2,19.7 36.4,19.9 36.4,21 35,22.4 v29.3,22.4
  Bottom 0.15: U1.P$T2 36.1,17.15 36.1,17.8 36.2,17.9 v36.2,18.2 | v29.3,22.4 29.3,21.7 28.3,20.7 25.9,20.7 24,22.6 20.9,22.6 18.8,24.7 18.8,27.8 18.6,28 17.1,28 16.2,28.9 16.2,31.2 15,32.4 IC1.A1
  other vias: 36,17.05 13.6,32.4
PREVGH  (via drill 0.2)
  Top 0.15: EPD_C9.2 12.1,12.7 11.55,13.25 J1.21 9.85,13.25 9.6,13 9.6,10 10.4,9.2 16.9,9.2 v17.4,9.7 | D5.1 19.2,8 v18.4,8.8
  Bottom 0.15: v18.4,8.8 17.5,9.7 v17.4,9.7
PREVGL  (via drill 0.2)
  Top 0.15: EPD_C11.2 12.18,11.3 11.22,12.25 J1.23 10.22,12.25 10,12.03 v10,11.1 | D2.2 23.05,10.45 v23,10.4 | v20.2,9.9 18,9.9 17.7,10.2 v15.4,10.2
  Bottom 0.15: v23,10.4 22.5,9.9 v20.2,9.9 | v15.4,10.2 14.5,9.3 10.5,9.3 10,9.8 v10,11.1
RESE  (via drill 0.2)
  Top 0.15: v15.8,21.5 15.8,21.73 R1_EP_DR.2 14.9,22.02 v14.9,21.5 | v16.4,17.6 16.35,17.55 Q3.2 | v14.1,22.6 14,22.5 11.9,22.5 11.66,22.26 10.64,22.26 J1.3
  Bottom 0.15: v15.8,21.5 16.4,20.9 v16.4,17.6 | v14.9,21.5 14.9,21.8 v14.1,22.6
RESET  (via drill 0.2)
  Top 0.15: TP_RESET.TP 42.6,24 41.1,25.5 37.75,25.5 35.53,27.71 J2.6 35.13,27.71 34.73,27.31 34.73,25.23 34.1,24.6 32.3,24.6 v31.6,23.9 | v31,14.6 30,14.6 v29.9,14.7 | v29.9,17 29.5,17 v27.6,18.9
  Bottom 0.15: U1.P$AC13 34.15,14.3 33.85,14.6 33.6,14.6 32.5,13.5 32.1,13.5 v31,14.6 | v29.9,17 v29.9,14.7 | v31.6,23.9 31,23.3 31,22.3 v27.6,18.9
  other vias: 34.25,14.3
RF
  Top 0.15: C22.1 36.1,5.79 L1.2 C4.1 39.45,6.14 40.3,5.3 ANT1.1
SCK  (via drill 0.2, 0.35)
  Top 0.15: v35.2,7.2 33.9,7.2 v33.4,7.7 | v26.8,6.4 26.8,6.6 26.5,6.9 25.2,6.9 25,6.7 9.6,6.7 v8.6,5.7 | v8.5,12.3 8.5,16 9.8,17.3 10.57,17.3 J1.13
  Bottom 0.15: U1.P$A12 41.4,13.4 41.4,9 40.8,8.4 36.2,8.4 35.2,7.4 v35.2,7.2 | v33.4,7.7 31.8,6.1 31.4,6.1 30.7,5.4 27.8,5.4 v26.8,6.4 | v8.5,12.3 8.6,12.2 v8.6,5.7
  other vias: 40.25,14.55
SCL  (via drill 0.2)
  Top 0.15: 6.05,28.85 6.05,28.05 5.9,27.9 4.9,27.9 4.73,27.73 R17.2 | R17.2 3.8,27.4 TP_SCL.TP | 29.93,7.7 IC3.12 30.25,7.75 v30.5,8 | v33.2,20.5 33,20.7 v31.6,20.7 | R4.1 8,29.1 v7.9,29 | v6.8,28.1 6.05,28.85 | 6.05,28.85 U3.7 | R17.2 4.6,27.27 v4.6,26.6
  Top 0.152: IC1.B1 14.4,32.8 14.5,32.7 v14.5,32 | v10.1,30.7 12.1,30.7 v12.8,31.4 13.5,30.7 17,30.7 17.2,30.5 17.2,27.6 17.6,27.2 19.5,27.2 19.8,26.9 v19.8,26.2 | v10.1,29.7 10,29.6 9.22,29.6 8.82,29.2 R4.1
  Bottom 0.15: U1.P$M2 37,18.5 34.4,21.1 33.8,21.1 v33.2,20.5 | v31.6,20.7 31.1,20.7 29.5,19.1 29.5,9.6 30.5,8.6 v30.5,8 | v7.9,29 7.7,29 v6.8,28.1 | v4.6,26.6 4.6,25.5 5.1,25 7.1,25 7.6,24.5 7.6,10.4 5.6,8.4 IC2.C1
  Bottom 0.152: v14.5,32 13.9,31.4 v12.8,31.4 | v10.1,30.7 v10.1,29.7 | v19.8,26.2 20.8,26.2 21,26 31.1,26 33,24.1 33,21.9 32.8,21.7 32.8,21 33.2,20.6 v33.2,20.5
  other vias: 37,17.05 5.6,6.9
SDA  (via drill 0.2)
  Top 0.15: IC3.2 29.3,8.32 v29.3,9.1 | v37.6,18.2 37.25,17.85 U1.P$L1 | v33.3,21.2 33.1,21.4 v31.6,21.4 | U3.8 7.43,28.33 8.06,27.7 R2.1 8.82,28.32 9.1,28.6 9.3,28.6 v9.4,28.5 | v28.3,17.6 v23.8,22.1 | v17.8,25.5 17.8,26.4 16.7,27.5 v16.7,30 | v15.4,33.2 IC1.C1 | v5.5,25.5 5.2,25.8 5.2,26.2
  Top 0.152: TP_SDA.TP 1.7,26.2 5.2,26.2 R18.2 5.23,26.52 5.6,26.9 6.5,26.9 7.43,27.83 7.43,28.33
  Bottom 0.15: v37.6,18.2 37.6,18.3 34.5,21.4 33.5,21.4 v33.3,21.2 | v31.6,21.4 31.3,21.4 28.3,18.4 v28.3,17.6 28.6,17.3 28.6,9.8 v29.3,9.1 | v9.4,28.5 9.5,28.5 12.4,31.4 12.4,32 IC1.C1 | v23.8,22.1 19,22.1 17.8,23.3 v17.8,25.5 | v16.7,30 16.7,31.9 v15.4,33.2 | IC2.B2 5.7,5.8 6.3,5.8 7.2,6.7 7.2,9.6 8,10.4 8,24.6 7,25.6 5.6,25.6 v5.5,25.5
  other vias: 13.6,33.2 5.1,6.4
SWDCLK  (via drill 0.2)
  Top 0.15: J2.4 36.15,29.9 39.4,29.9 39.6,30.1 TP_SWDCLK.TP 43.2,30.9 v44.4,30.9 | U1.P$AA24 34.75,10.05 34.9,9.9 37.8,9.9 39.2,8.5 44.5,8.5 v45.1,9.1
  Bottom 0.15: 44.5,30.8 v44.4,30.9 45.1,30.2 45.1,28.5 45.6,28 45.6,9.6 v45.1,9.1
SWDIO  (via drill 0.2)
  Top 0.15: J2.2 35.6,30.62 35.6,33.8 35.9,34.1 40.3,34.1 TP_SWDIO.TP 39.8,31 v39.7,31 | U1.P$AC24 34.25,10.15 34.8,9.6 37.7,9.6 39.1,8.2 45,8.2 45.6,8.8 45.6,25.7 41.5,25.7 39.9,27.3 v39.9,28.2
  Bottom 0.15: v39.9,28.2 39.7,28.4 v39.7,31
SWO
  Top 0.15: U1.P$AD22 28.95,12.05 TP_SWO.TP
VBAT  (via drill 0.35)
  Top 0.3: TP_VBAT.TP 5.29,32.1 C27.2 5.55,32.37 U3.3 U3.2 6.05,31.85 6.3,32.1 v7,32.1 | IC1.C2 12.5,33.2 11.26,34.44 C37.2 11,34.39 10.29,34.39 v9.3,33.4
  Bottom 0.3: v9.3,33.4 9.3,32.9 8.5,32.1 v7,32.1
VBUS  (via drill 0.35)
  Top 0.3: IC1.A2 13.2,32.1 14.2,31.1 15.48,31.1 16.3,32.01 C38.2 17.6,31.12 17.6,28.3 18.2,27.7 20,27.7 20.3,28 | J4.A4_B9 25.5,29.07 25.5,28.5 26.38,27.62 C42.1 26.79,26.6 26.79,25.34 C43.1 | 20.4,28.98 J4.A9_B4 20.6,28.5 20.3,28.2 20.3,28 | v32.6,18.9 C21.1 32.8,18 U1.P$AD2 | 20.3,28 20.3,24.4 21.4,23.3 22.6,23.3 23.1,23.8 | 23.1,23.8 D3.5 | C43.1 26.55,24.85 24.9,23.2 23.7,23.2 23.1,23.8 | C43.1 28.5,25.1 v29.1,24.5
  Bottom 0.3: v29.1,24.5 32.1,24.5 32.3,24.3 32.3,19.2 v32.6,18.9
VREG
  Top 0.3: IC9.A3 IC9.A2 IC9.A1 11.2,30.2 C24.2 8.95,31.15 8.8,31.3 C23.2 | IC1.B2 12.4,32.8 11.4,31.8 10.25,31.8 C39.1 9.65,31.3 C23.2 | 7.3,33.2 7.3,33.4 | 7.3,33.4 TP_VREG.TP | C23.2 8.69,32.02 7.3,33.4
(copper drawn outside any net)
  shapes: Bottom area x1, Route15 area x1, Route2 area x1, Top area x1